# EAGLE schematic oresat-batteries (EAGLE 9.6.2)

## Sheet 1 of 5: Connectors/MCU
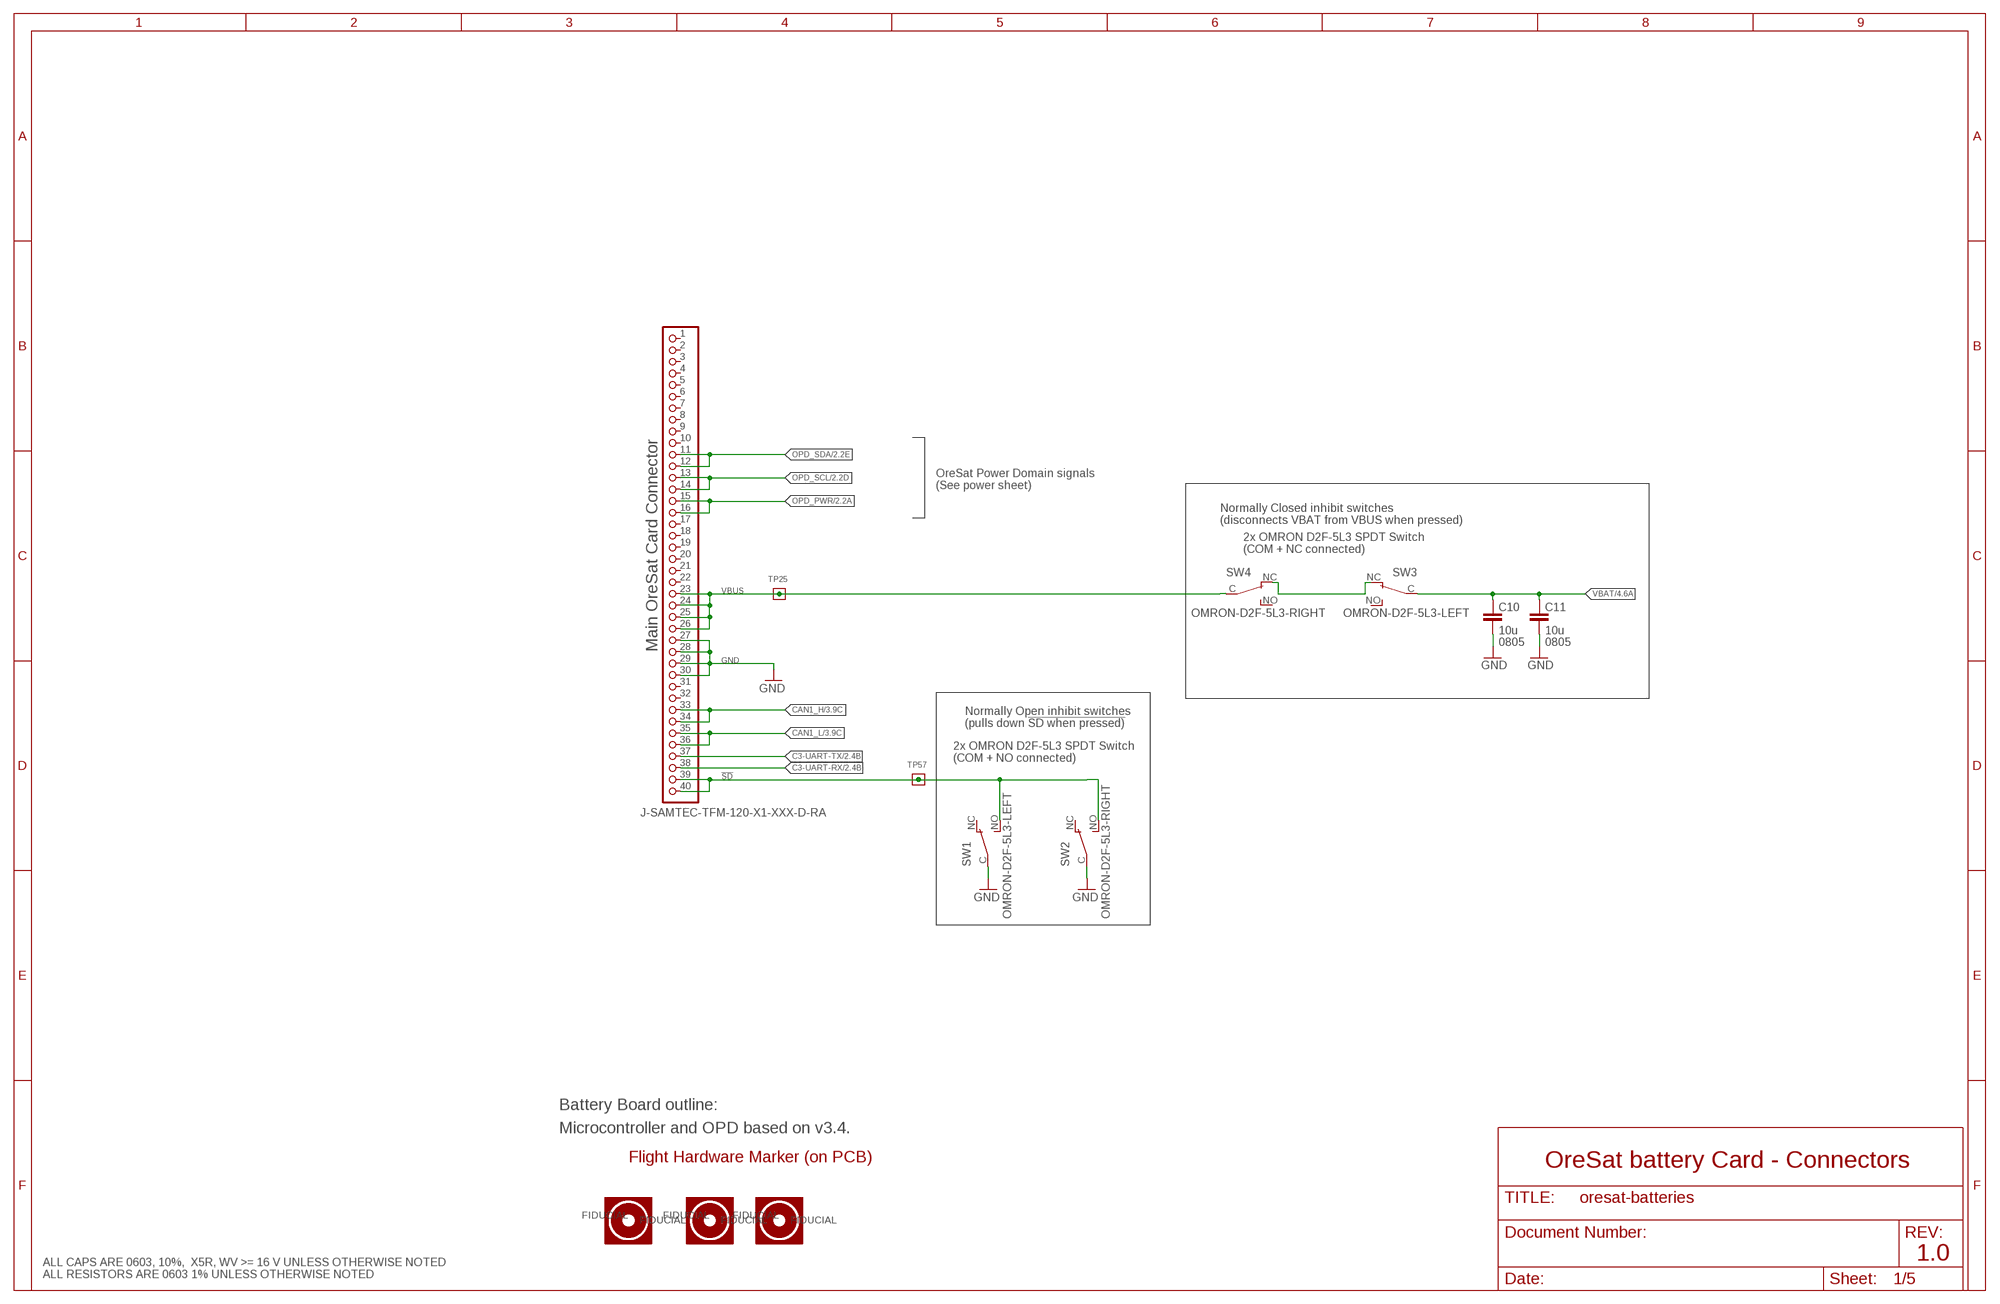
[diagram p0: schematic, sheet 1]

### Parts
C10  10u  C-EU0805-B-NOSILK  [.0805-B-NOSILK]
C11  10u  C-EU0805-B-NOSILK  [.0805-B-NOSILK]
FIDUCIAL1  FIDUCIAL-1.0X2.0  [FIDUCIAL-1.0X2.0]
FIDUCIAL2  FIDUCIAL-1.0X2.0  [FIDUCIAL-1.0X2.0]
FIDUCIAL3  FIDUCIAL-1.0X2.0  [FIDUCIAL-1.0X2.0]
J1  J-SAMTEC-TFM-120-X1-XXX-D-RA  [J-SAMTEC-TFM-120-X1-XXX-D-RA]
SW1  OMRON-D2F-5L3-LEFT  OMRON-D2F-L3-D-LEFT  [D2F-L3-D-HORIZONTAL-L]
SW2  OMRON-D2F-5L3-RIGHT  OMRON-D2F-L3-D-RIGHT  [D2F-L3-D-HORIZONTAL-R]
SW3  OMRON-D2F-5L3-LEFT  OMRON-D2F-L3-D-LEFT  [D2F-L3-D-HORIZONTAL-L]
SW4  OMRON-D2F-5L3-RIGHT  OMRON-D2F-L3-D-RIGHT  [D2F-L3-D-HORIZONTAL-R]
TP25  TEST-POINT-LARGE-SQUARE  [1X01]
TP57  TEST-POINT-LARGE-SQUARE  [1X01]
U$1  FLIGHMARKERNEW  [FLIGHTMARKER_NEW_BOARDS]

### Nets
!SD [SHUTDOWN]: J1.39 J1.40 SW1.NO SW2.NO TP57.1 ; also sheet 4,5
C3-UART-RX: J1.38 ; also sheet 2
C3-UART-TX: J1.37 ; also sheet 2
CAN1_H: J1.33 J1.34 ; also sheet 3
CAN1_L: J1.35 J1.36 ; also sheet 3
GND: C10.2 C11.2 J1.27 J1.28 J1.29 J1.30 SW1.C(COM) SW2.C(COM) ; also sheet 2,3,4,5
INTERSW: SW3.NC SW4.NC
OPD_PWR: J1.15 J1.16 ; also sheet 2
OPD_SCL: J1.13 J1.14 ; also sheet 2
OPD_SDA: J1.11 J1.12 ; also sheet 2
VBAT: C10.1 C11.1 SW3.C(COM) ; also sheet 4,5
VBUS [BATTERY]: J1.23 J1.24 J1.25 J1.26 SW4.C(COM) TP25.1 ; also sheet 2
Unconnected: FIDUCIAL1.FIDUCIAL FIDUCIAL2.FIDUCIAL FIDUCIAL3.FIDUCIAL J1.1 J1.2 J1.3 J1.4 J1.5 J1.6 J1.7 J1.8 J1.9 J1.10 J1.17 J1.18 J1.19 J1.20 J1.21 J1.22 J1.31 J1.32 SW1.NC SW2.NC SW3.NO SW4.NO

### Notes on the sheet
- OreSat Power Domain signals
  (See power sheet)
- Normally Closed inhibit switches
  (disconnects VBAT from VBUS when pressed)
- 2x OMRON D2F-5L3 SPDT Switch
  (COM + NC connected)
- 0805 | 0805
- Main OreSat Card Connector
- Normally Open inhibit switches
  (pulls down !SD when pressed)
- 2x OMRON D2F-5L3 SPDT Switch
  (COM + NO connected)
- Battery Board outline:
- Microcontroller and OPD based on v3.4.
- OreSat battery Card - Connectors
- 1.0
- ALL CAPS ARE 0603, 10%,  X5R, WV >= 16 V UNLESS OTHERWISE NOTED
  ALL RESISTORS ARE 0603 1% UNLESS OTHERWISE NOTED

## Sheet 2 of 5: Power
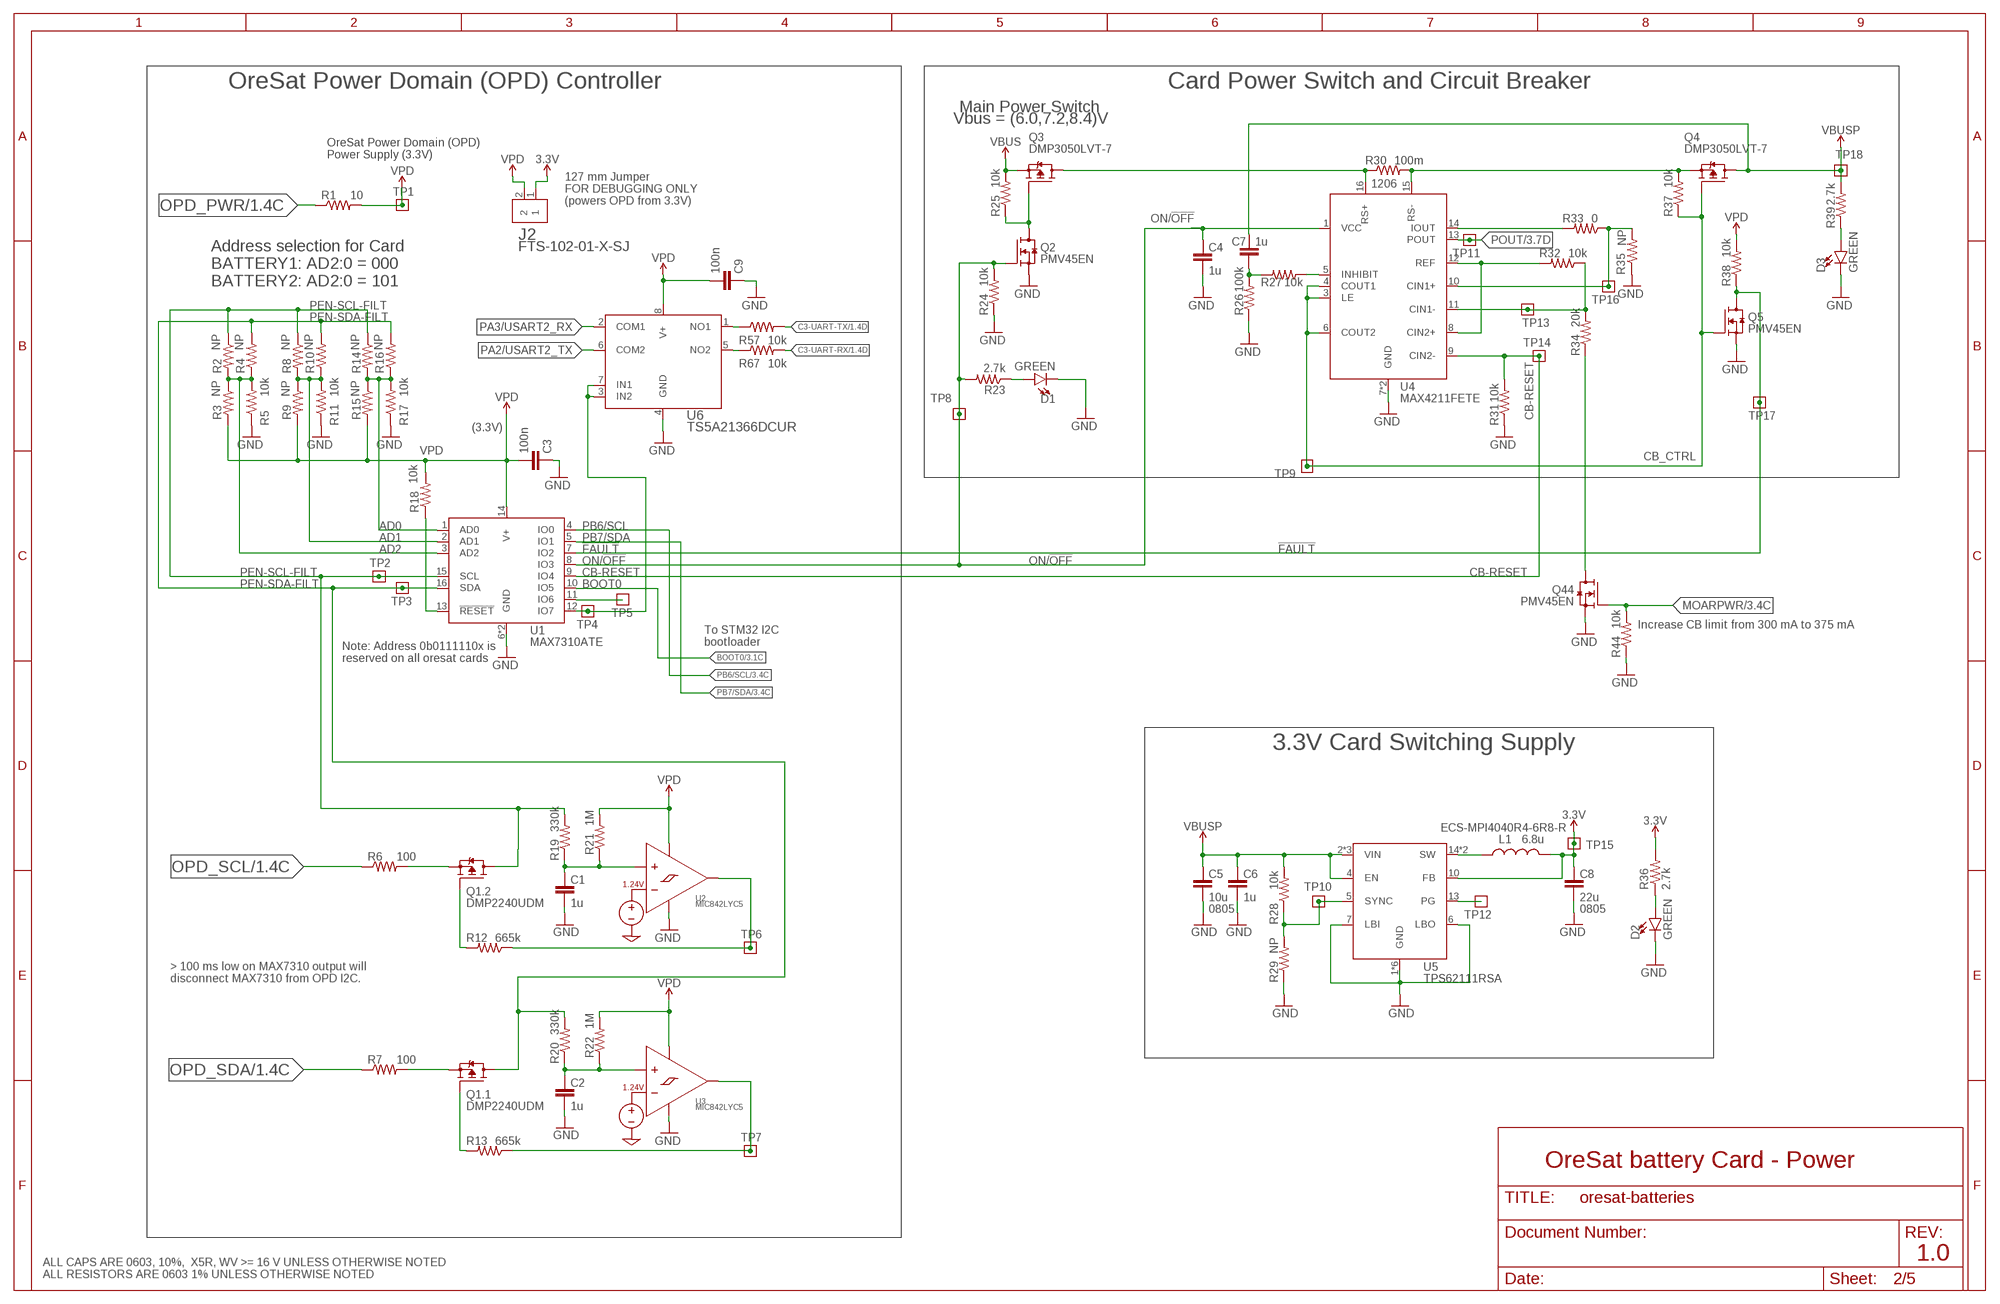
[diagram p1: schematic, sheet 2]

### Parts
C1  1u  C-EU0603-C-NOSILK  [.0603-C-NOSILK]
C2  1u  C-EU0603-C-NOSILK  [.0603-C-NOSILK]
C3  100n  C-EU0603-C-NOSILK  [.0603-C-NOSILK]
C4  1u  C-EU0603-C-NOSILK  [.0603-C-NOSILK]
C5  10u  C-EU0805-B-NOSILK  [.0805-B-NOSILK]
C6  1u  C-EU0603-C-NOSILK  [.0603-C-NOSILK]
C7  1u  C-EU0603-C-NOSILK  [.0603-C-NOSILK]
C8  22u  C-EU0805-B-NOSILK  [.0805-B-NOSILK]
C9  100n  C-EU0603-C-NOSILK  [.0603-C-NOSILK]
D1  GREEN  LED-GREEN0603  [LED-0603]
D2  GREEN  LED-GREEN0603  [LED-0603]
D3  GREEN  LED-GREEN0603  [LED-0603]
J2  FTS-102-01-X-SJ  SAMTEC-FTS-102-01-X-SJ  [SAMTEC-FTS-102-01-X-S]
L1  6.8u  L-ECS-MPI4040  [ECS-MPI4040]
Q1  DMP2240UDM  MOSFET-PCH-SOT23-6  [SOT23-6]
Q2  PMV45EN  N-MOSFET-SOT-23-3  [SOT23-3]
Q3  DMP3050LVT-7  MOSFET-PCH-SOT23-6  [SOT23-6]
Q4  DMP3050LVT-7  MOSFET-PCH-SOT23-6  [SOT23-6]
Q5  PMV45EN  N-MOSFET-SOT-23-3  [SOT23-3]
Q44  PMV45EN  N-MOSFET-SOT-23-3  [SOT23-3]
R1  10  R-US_0603-C-NOSILK  [.0603-C-NOSILK]
R2  NP  R-US_0603-C-NOSILK  [.0603-C-NOSILK]
R3  NP  R-US_0603-C-NOSILK  [.0603-C-NOSILK]
R4  NP  R-US_0603-C-NOSILK  [.0603-C-NOSILK]
R5  10k  R-US_0603-C-NOSILK  [.0603-C-NOSILK]
R6  100  R-US_0603-C-NOSILK  [.0603-C-NOSILK]
R7  100  R-US_0603-C-NOSILK  [.0603-C-NOSILK]
R8  NP  R-US_0603-C-NOSILK  [.0603-C-NOSILK]
R9  NP  R-US_0603-C-NOSILK  [.0603-C-NOSILK]
R10  NP  R-US_0603-C-NOSILK  [.0603-C-NOSILK]
R11  10k  R-US_0603-C-NOSILK  [.0603-C-NOSILK]
R12  665k  R-US_0603-C-NOSILK  [.0603-C-NOSILK]
R13  665k  R-US_0603-C-NOSILK  [.0603-C-NOSILK]
R14  NP  R-US_0603-C-NOSILK  [.0603-C-NOSILK]
R15  NP  R-US_0603-C-NOSILK  [.0603-C-NOSILK]
R16  NP  R-US_0603-C-NOSILK  [.0603-C-NOSILK]
R17  10k  R-US_0603-C-NOSILK  [.0603-C-NOSILK]
R18  10k  R-US_0603-C-NOSILK  [.0603-C-NOSILK]
R19  330k  R-US_0603-C-NOSILK  [.0603-C-NOSILK]
R20  330k  R-US_0603-C-NOSILK  [.0603-C-NOSILK]
R21  1M  R-US_0603-C-NOSILK  [.0603-C-NOSILK]
R22  1M  R-US_0603-C-NOSILK  [.0603-C-NOSILK]
R23  2.7k  R-US_0603-C-NOSILK  [.0603-C-NOSILK]
R24  10k  R-US_0603-C-NOSILK  [.0603-C-NOSILK]
R25  10k  R-US_0603-C-NOSILK  [.0603-C-NOSILK]
R26  100k  R-US_0603-C-NOSILK  [.0603-C-NOSILK]
R27  10k  R-US_0603-C-NOSILK  [.0603-C-NOSILK]
R28  10k  R-US_0603-C-NOSILK  [.0603-C-NOSILK]
R29  NP  R-US_0603-C-NOSILK  [.0603-C-NOSILK]
R30  100m  R-US_1206-C  [1206-C]
R31  10k  R-US_0603-C-NOSILK  [.0603-C-NOSILK]
R32  10k  R-US_0603-C-NOSILK  [.0603-C-NOSILK]
R33  0  R-US_0603-C-NOSILK  [.0603-C-NOSILK]
R34  20k  R-US_0603-C-NOSILK  [.0603-C-NOSILK]
R35  NP  R-US_0603-C-NOSILK  [.0603-C-NOSILK]
R36  2.7k  R-US_0603-C-NOSILK  [.0603-C-NOSILK]
R37  10k  R-US_0603-C-NOSILK  [.0603-C-NOSILK]
R38  10k  R-US_0603-C-NOSILK  [.0603-C-NOSILK]
R39  2.7k  R-US_0603-C-NOSILK  [.0603-C-NOSILK]
R44  10k  R-US_0603-C-NOSILK  [.0603-C-NOSILK]
R57  10k  R-US_0603-C-NOSILK  [.0603-C-NOSILK]
R67  10k  R-US_0603-C-NOSILK  [.0603-C-NOSILK]
TP1  TEST-POINT-LARGE-SQUARE  [1X01]
TP2  TEST-POINT-LARGE-SQUARE  [1X01]
TP3  TEST-POINT-LARGE-SQUARE  [1X01]
TP4  TEST-POINT-LARGE-SQUARE  [1X01]
TP5  TEST-POINT-LARGE-SQUARE  [1X01]
TP6  TEST-POINT-LARGE-SQUARE  [1X01]
TP7  TEST-POINT-LARGE-SQUARE  [1X01]
TP8  TEST-POINT-LARGE-SQUARE  [1X01]
TP9  TEST-POINT-LARGE-SQUARE  [1X01]
TP10  TEST-POINT-LARGE-SQUARE  [1X01]
TP11  TEST-POINT-LARGE-SQUARE  [1X01]
TP12  TEST-POINT-LARGE-SQUARE  [1X01]
TP13  TEST-POINT-LARGE-SQUARE  [1X01]
TP14  TEST-POINT-LARGE-SQUARE  [1X01]
TP15  TEST-POINT-LARGE-SQUARE  [1X01]
TP16  TEST-POINT-LARGE-SQUARE  [1X01]
TP17  TEST-POINT-LARGE-SQUARE  [1X01]
TP18  TEST-POINT-LARGE-SQUARE  [1X01]
U1  MAX7310ATE  MAX7310  [QFN65P400X400X80-17T210]
U2  MIC842LYC5  [SC70-5]
U3  MIC842LYC5  [SC70-5]
U4  MAX4211FETE  MAX4211  [QFN65P400X400X80-17T210]
U5  TPS62111RSA  TPS6211X  [S-PVQFN-16]
U6  TS5A21366DCUR  [DCU0008A_N]

### Nets
3.3V: C8.1 J2.1 L1.2 R36.2 TP15.1 U5.10(FB) ; also sheet 3
!FAULT: Q5.3(D) R38.1 TP17.1 U1.7(IO2)
AD0: R14.2 R15.1 R16.1 R17.2 U1.1(AD0)
AD1: R8.2 R9.1 R10.1 R11.2 U1.2(AD1)
AD2: R2.2 R3.1 R4.1 R5.2 U1.3(AD2)
BOOT0: U1.10(IO5) ; also sheet 3
C3-UART-RX: R67.2 ; also sheet 1
C3-UART-TX: R57.2 ; also sheet 1
CB-RESET: R31.2 TP14.1 U1.9(IO4) U4.9(CIN2-)
CB_CTRL: Q4.3(G) Q5.1(G) R37.1 TP9.1 U4.3(LE) U4.4(COUT1) U4.6(COUT2)
GND: C1.2 C2.2 C3.1 C4.2 C5.2 C6.2 C8.2 C9.1 D1.C D2.C D3.C Q2.2(S) Q5.2(S) Q44.2(S) R5.1 R11.1 R17.1 R24.1 R26.1 R29.1 R31.1 R35.1 R44.1 U1.6(GND) U1.EPAD(GND) U2.2(GND) U3.2(GND) U4.7(GND) U4.EPAD(GND) U5.1(GND) U5.6(LBO) U5.7(LBI) U5.9(GND) U5.11(GND) U5.12(GND) U5.16(GND) U5.PAD(GND) U6.4(GND) ; also sheet 1,3,4,5
IOUT1: R33.2 U4.14(IOUT)
MOARPWR: Q44.1(G) R44.2 ; also sheet 3
N$1: R57.1 U6.1(NO1)
N$13: R67.1 U6.5(NO2)
N$19: D3.A R39.1
N$20: D2.A R36.1
N$21: R18.1 U1.13(!RESET)
N$23: Q2.3(D) Q3.3(G) R25.1
N$24: Q3.1(D) Q3.2(D) Q3.5(D) Q3.6(D) R30.1 U4.16(RS+)
N$28: Q1.1(.1:G) R13.2
N$29: Q44.3(D) R34.1
N$30: Q1.3(.2:G) R12.2
N$32: R33.1 R35.2 TP16.1 U4.10(CIN1+)
N$33: R32.1 R34.2 TP13.1 U4.11(CIN1-)
N$34: R32.2 U4.8(CIN2+) U4.12(REF)
N$35: R27.1 U4.5(INHIBIT)
N$36: C7.1 R26.2 R27.2
N$38: Q4.4(S) R30.2 R37.2 U4.15(RS-)
N$39: D1.A R23.1
N$45: Q1.5(.1:S) R7.2
N$47: R13.1 TP7.1 U3.4(OUT)
N$49: TP5.1 U1.11(IO6)
N$52: Q1.2(.2:S) R6.2
N$57: R12.1 TP6.1 U2.4(OUT)
N$58: C1.1 R19.1 R21.1 U2.1(INP)
N$59: C2.1 R20.1 R22.1 U3.1(INP)
N$60: TP4.1 U1.12(IO7) U6.3(IN2) U6.7(IN1)
ON/!OFF: C4.1 Q2.1(G) R23.2 R24.2 TP8.1 U1.8(IO3) U4.1(VCC)
OPD_PWR: R1.1 ; also sheet 1
OPD_SCL: R6.1 ; also sheet 1
OPD_SDA: R7.1 ; also sheet 1
PA2/USART2_TX: U6.6(COM2) ; also sheet 3
PA3/USART2_RX: U6.2(COM1) ; also sheet 3
PB6/SCL: U1.4(IO0) ; also sheet 3,5
PB7/SDA: U1.5(IO1) ; also sheet 3,5
PEN-SCL-FILT: Q1.4(.2:D) R2.1 R8.1 R14.1 R19.2 TP2.1 U1.15(SCL)
PEN-SDA-FILT: Q1.6(.1:D) R4.2 R10.2 R16.2 R20.2 TP3.1 U1.16(SDA)
POUT: TP11.1 U4.13(POUT) ; also sheet 3
TPS62111-PG1: TP12.1 U5.13(PG)
TPS62111-SYNC1: R28.1 R29.2 TP10.1 U5.5(SYNC)
TPS62111_SW1: L1.1 U5.14(SW) U5.15(SW)
VBUS [BATTERY]: Q3.4(S) R25.2 ; also sheet 1
VBUSP: C5.1 C6.1 C7.2 Q4.1(D) Q4.2(D) Q4.5(D) Q4.6(D) R28.2 R39.2 TP18.1 U5.2(VIN) U5.3(VIN) U5.4(EN) U5.8(VIN) ; also sheet 3
VPD: C3.2 C9.2 J2.2 R1.2 R3.2 R9.2 R15.2 R18.2 R21.2 R22.2 R38.2 TP1.1 U1.14(V+) U2.5(VDD) U3.5(VDD) U6.8(V+)

### Notes on the sheet
- OreSat Power Domain (OPD) Controller | Card Power Switch and Circuit Breaker
- Main Power Switch
- Vbus = (6.0,7.2,8.4)V
- OreSat Power Domain (OPD)
  Power Supply (3.3V)
- 1206
- 127 mm Jumper
  FOR DEBUGGING ONLY
  (powers OPD from 3.3V)
- Address selection for Card
- BATTERY1: AD2:0 = 000
  BATTERY2: AD2:0 = 101
- (3.3V)
- Increase CB limit from 300 mA to 375 mA
- To STM32 I2C
  bootloader
- Note: Address 0b0111110x is 
  reserved on all oresat cards
- 3.3V Card Switching Supply
- ECS-MPI4040R4-6R8-R
- 0805 | 0805
- > 100 ms low on MAX7310 output will
  disconnect MAX7310 from OPD I2C.
- OreSat battery Card - Power
- 1.0
- ALL CAPS ARE 0603, 10%,  X5R, WV >= 16 V UNLESS OTHERWISE NOTED
  ALL RESISTORS ARE 0603 1% UNLESS OTHERWISE NOTED

## Sheet 3 of 5: Microcontroller
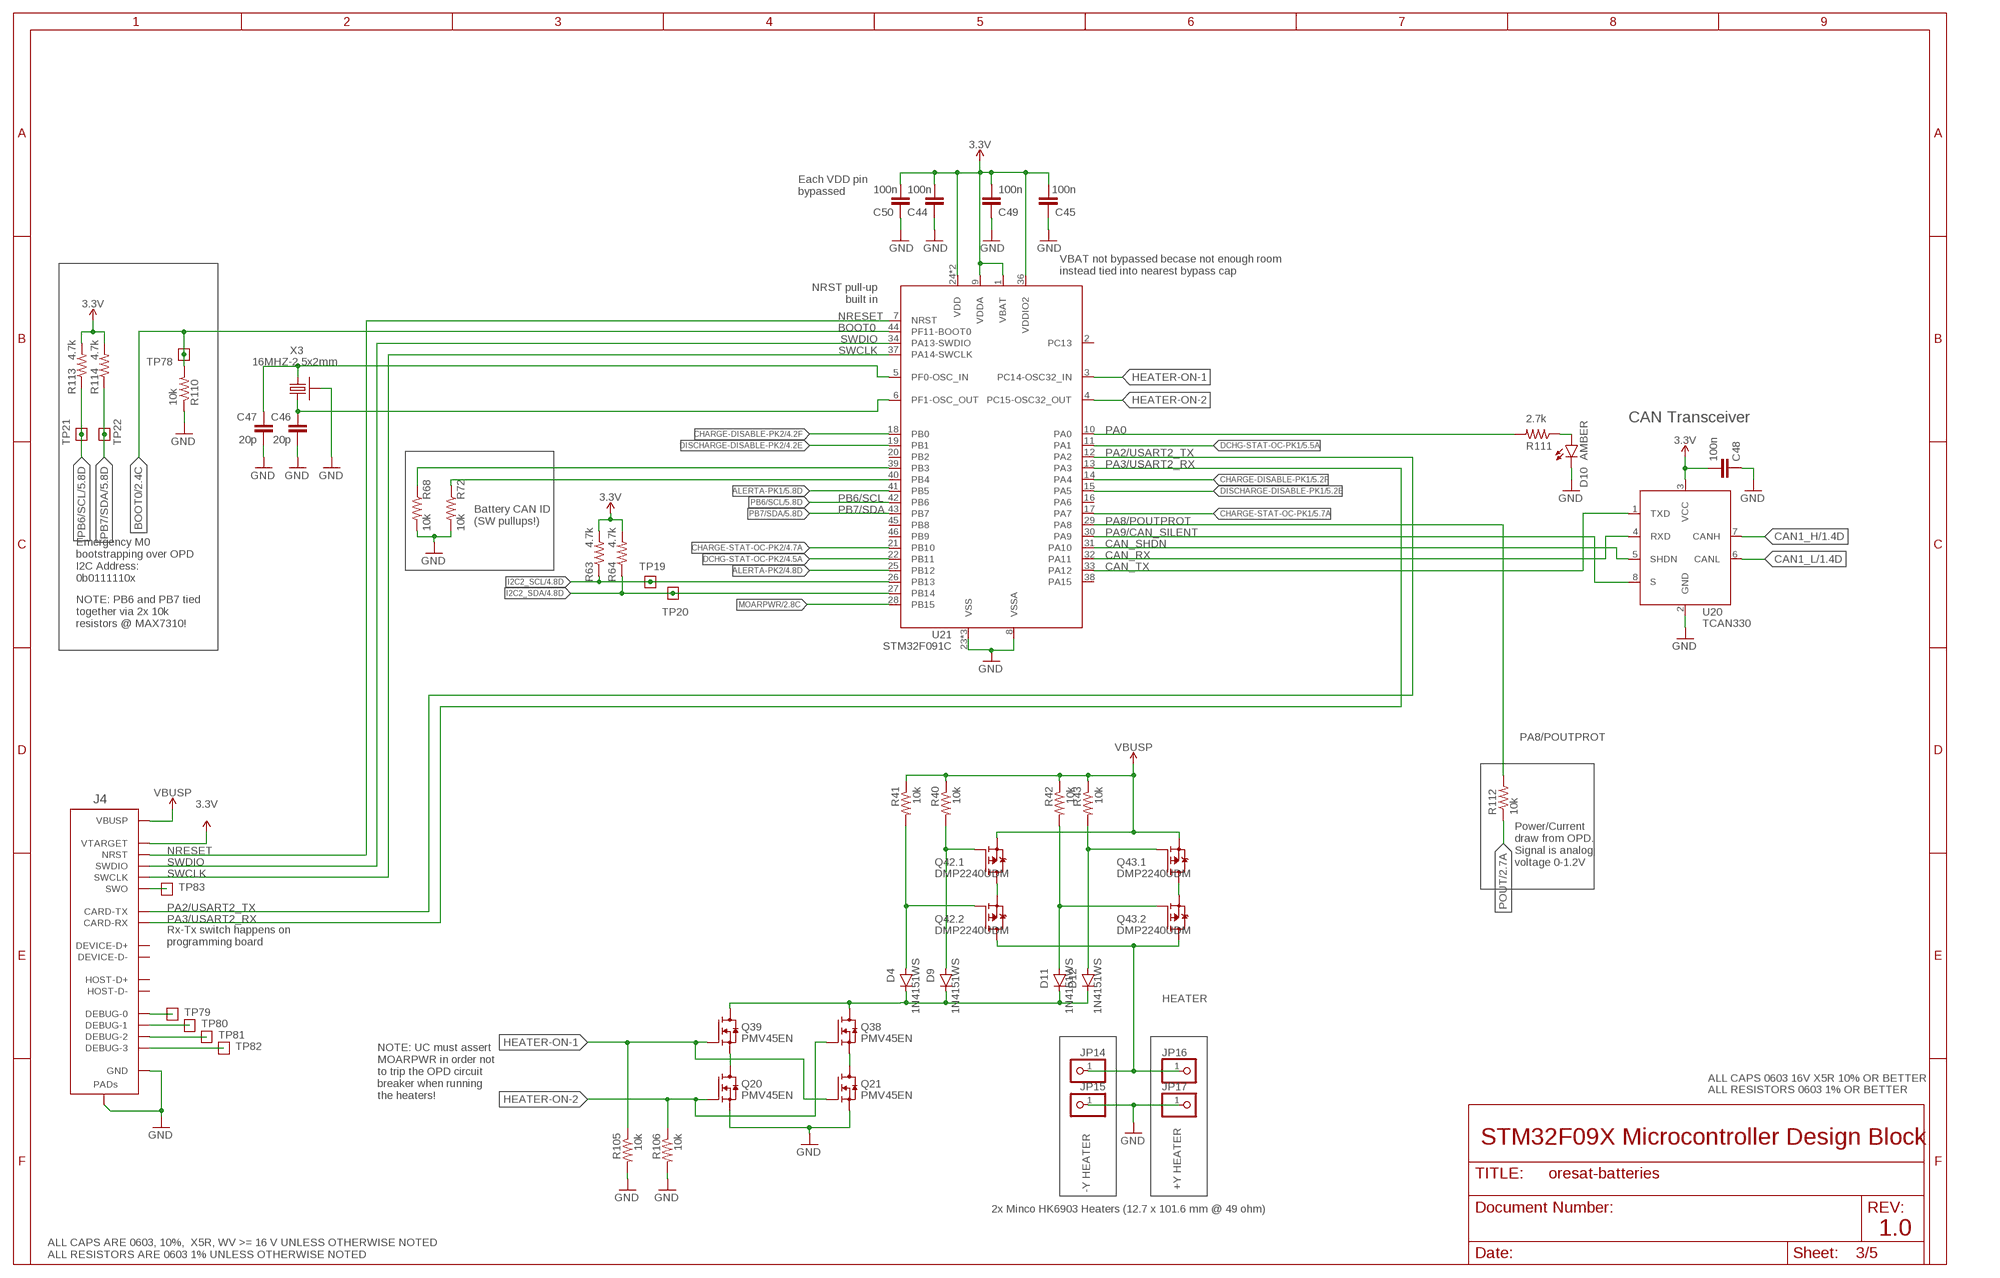
[diagram p2: schematic, sheet 3]

### Parts
C44  100n  C-EU0603-C-NOSILK  [.0603-C-NOSILK]
C45  100n  C-EU0603-C-NOSILK  [.0603-C-NOSILK]
C46  20p  C-EU0603-C-NOSILK  [.0603-C-NOSILK]
C47  20p  C-EU0603-C-NOSILK  [.0603-C-NOSILK]
C48  100n  C-EU0603-C-NOSILK  [.0603-C-NOSILK]
C49  100n  C-EU0603-C-NOSILK  [.0603-C-NOSILK]
C50  100n  C-EU0603-C-NOSILK  [.0603-C-NOSILK]
D4  1N4151WS  DIODE-SOD323-R  [SOD323-R]
D9  1N4151WS  DIODE-SOD323-R  [SOD323-R]
D10  AMBER  LED-GREEN0603  [LED-0603]
D11  1N4151WS  DIODE-SOD323-R  [SOD323-R]
D12  1N4151WS  DIODE-SOD323-R  [SOD323-R]
J4  ORESAT-DEBUG-CONNECTOR-ALL  [TE_2-1734592-0]
JP14  PINHD-1X1  [1X01]
JP15  PINHD-1X1  [1X01]
JP16  PINHD-1X1  [1X01]
JP17  PINHD-1X1  [1X01]
Q20  PMV45EN  N-MOSFET-SOT-23-3  [SOT23-3]
Q21  PMV45EN  N-MOSFET-SOT-23-3  [SOT23-3]
Q38  PMV45EN  N-MOSFET-SOT-23-3  [SOT23-3]
Q39  PMV45EN  N-MOSFET-SOT-23-3  [SOT23-3]
Q42  DMP2240UDM  MOSFET-PCH-SOT23-6  [SOT23-6]
Q43  DMP2240UDM  MOSFET-PCH-SOT23-6  [SOT23-6]
R40  10k  R-US_0603-C-NOSILK  [.0603-C-NOSILK]
R41  10k  R-US_0603-C-NOSILK  [.0603-C-NOSILK]
R42  10k  R-US_0603-C-NOSILK  [.0603-C-NOSILK]
R43  10k  R-US_0603-C-NOSILK  [.0603-C-NOSILK]
R63  4.7k  R-US_0603-C-NOSILK  [.0603-C-NOSILK]
R64  4.7k  R-US_0603-C-NOSILK  [.0603-C-NOSILK]
R68  10k  R-US_0603-C-NOSILK  [.0603-C-NOSILK]
R72  10k  R-US_0603-C-NOSILK  [.0603-C-NOSILK]
R105  10k  R-US_0603-C-NOSILK  [.0603-C-NOSILK]
R106  10k  R-US_0603-C-NOSILK  [.0603-C-NOSILK]
R110  10k  R-US_0603-C-NOSILK  [.0603-C-NOSILK]
R111  2.7k  R-US_0603-C-NOSILK  [.0603-C-NOSILK]
R112  10k  R-US_0603-C-NOSILK  [.0603-C-NOSILK]
R113  4.7k  R-US_0603-C-NOSILK  [.0603-C-NOSILK]
R114  4.7k  R-US_0603-C-NOSILK  [.0603-C-NOSILK]
TP19  TEST-POINT-LARGE-SQUARE  [1X01]
TP20  TEST-POINT-LARGE-SQUARE  [1X01]
TP21  TEST-POINT-LARGE-SQUARE  [1X01]
TP22  TEST-POINT-LARGE-SQUARE  [1X01]
TP78  TEST-POINT-LARGE-SQUARE  [1X01]
TP79  TEST-POINT-LARGE-SQUARE  [1X01]
TP80  TEST-POINT-LARGE-SQUARE  [1X01]
TP81  TEST-POINT-LARGE-SQUARE  [1X01]
TP82  TEST-POINT-LARGE-SQUARE  [1X01]
TP83  TEST-POINT-LARGE-SQUARE  [1X01]
U20  TCAN330  [SOT23-8_TI-DCN]
U21  STM32F091C  [STM32F091C]
X3  16MHZ-2.5x2mm  CRYSTAL-WITH-GND  [CRYSTAL_2.5X2]

### Nets
3.3V: C44.2 C45.2 C48.2 C49.2 C50.2 J4.11(VTARGET) R63.2 R64.2 R113.2 R114.2 U20.3(VCC) U21.1(VBAT) U21.9(VDDA) U21.24(VDD) U21.36(VDDIO2) U21.48(VDD) ; also sheet 2
ALERTA-PK1: U21.41(PB5) ; also sheet 5
ALERTA-PK2: U21.25(PB12) ; also sheet 4
BOOT0: R110.2 TP78.1 U21.44(PF11-BOOT0) ; also sheet 2
CAN1_H: U20.7(CANH) ; also sheet 1
CAN1_L: U20.6(CANL) ; also sheet 1
CAN_RX: U20.4(RXD) U21.32(PA11)
CAN_SHDN: U20.5(SHDN) U21.31(PA10)
CAN_TX: U20.1(TXD) U21.33(PA12)
CHARGE-DISABLE-PK1: U21.14(PA4) ; also sheet 5
CHARGE-DISABLE-PK2: U21.18(PB0) ; also sheet 4
CHARGE-STAT-OC-PK1: U21.17(PA7) ; also sheet 5
CHARGE-STAT-OC-PK2: U21.21(PB10) ; also sheet 4
CRYSTALIN2: C47.1 U21.5(PF0-OSC_IN) X3.1
CRYSTALOUT2: C46.1 U21.6(PF1-OSC_OUT) X3.3
DCHG-STAT-OC-PK1: U21.11(PA1) ; also sheet 5
DCHG-STAT-OC-PK2: U21.22(PB11) ; also sheet 4
DISCHARGE-DISABLE-PK1: U21.15(PA5) ; also sheet 5
DISCHARGE-DISABLE-PK2: U21.19(PB1) ; also sheet 4
GND: C44.1 C45.1 C46.2 C47.2 C48.1 C49.1 C50.1 D10.C J4.3(GND) J4.6(GND) J4.9(GND) J4.PAD1(PAD) J4.PAD2(PAD) JP15.1 JP17.1 Q20.2(S) Q21.2(S) R68.2 R72.2 R105.2 R106.2 R110.1 U20.2(GND) U21.8(VSSA) U21.23(VSS) U21.35(VSS) U21.47(VSS) X3.2(SHIELD) X3.4(SHIELD) ; also sheet 1,2,4,5
HEATER: JP14.1 JP16.1 Q42.4(.2:D) Q43.4(.2:D)
HEATER-ON-1: Q21.1(G) Q39.1(G) R105.1 U21.3(PC14-OSC32_IN)
HEATER-ON-2: Q20.1(G) Q38.1(G) R106.1 U21.4(PC15-OSC32_OUT)
I2C2_SCL: R63.1 TP19.1 U21.26(PB13) ; also sheet 4
I2C2_SDA: R64.1 TP20.1 U21.27(PB14) ; also sheet 4
MOARPWR: U21.28(PB15) ; also sheet 2
N$18: D11.A Q43.3(.2:G) R42.2
N$25: D4.A Q42.3(.2:G) R41.2
N$26: Q42.2(.2:S) Q42.6(.1:D)
N$27: Q43.2(.2:S) Q43.6(.1:D)
N$54: R68.1 U21.39(PB3)
N$62: D12.A Q43.1(.1:G) R43.2
N$63: D9.A Q42.1(.1:G) R40.2
N$64: D4.C D9.C D11.C D12.C Q38.3(D) Q39.3(D)
N$88: Q20.3(D) Q39.2(S)
N$92: Q21.3(D) Q38.2(S)
N$99: R72.1 U21.40(PB4)
N$101: D10.A R111.1
N$102: J4.20(DEBUG-3) TP82.1
N$103: J4.19(DEBUG-2) TP81.1
N$104: J4.18(DEBUG-1) TP80.1
N$105: J4.17(DEBUG-0) TP79.1
N$106: J4.16(SWO) TP83.1
NRESET: J4.10(NRST) U21.7(NRST)
PA0: R111.2 U21.10(PA0)
PA2/USART2_TX: J4.13(CARD-TX) U21.12(PA2) ; also sheet 2
PA3/USART2_RX: J4.12(CARD-RX) U21.13(PA3) ; also sheet 2
PA8/POUTPROT: R112.2 U21.29(PA8)
PA9/CAN_SILENT: U20.8(S) U21.30(PA9)
PB6/SCL: R113.1 TP21.1 U21.42(PB6) ; also sheet 2,5
PB7/SDA: R114.1 TP22.1 U21.43(PB7) ; also sheet 2,5
POUT: R112.1 ; also sheet 2
SWCLK: J4.15(SWCLK) U21.37(PA14-SWCLK)
SWDIO: J4.14(SWDIO) U21.34(PA13-SWDIO)
VBUSP: J4.1(VBUSP) J4.2(VBUSP) Q42.5(.1:S) Q43.5(.1:S) R40.1 R41.1 R42.1 R43.1 ; also sheet 2
Unconnected: J4.4(DEVICE-D+) J4.5(DEVICE-D-) J4.7(HOST-D+) J4.8(HOST-D-) U21.2(PC13) U21.16(PA6) U21.20(PB2) U21.38(PA15) U21.45(PB8) U21.46(PB9)

### Notes on the sheet
- Each VDD pin
  bypassed
- VBAT not bypassed becase not enough room
  instead tied into nearest bypass cap
- NRST pull-up
  built in
- CAN Transceiver
- Battery CAN ID
  (SW pullups!)
- Emergency M0 
  bootstrapping over OPD 
  I2C Address: 
  0b0111110x
- NOTE: PB6 and PB7 tied
  together via 2x 10k
  resistors @ MAX7310!
- Power/Current 
  draw from OPD.
  Signal is analog 
  voltage 0-1.2V
- Rx-Tx switch happens on 
  programming board
- HEATER
- ALL CAPS 0603 16V X5R 10% OR BETTER
- ALL RESISTORS 0603 1% OR BETTER
- NOTE: UC must assert 
  MOARPWR in order not 
  to trip the OPD circuit 
  breaker when running
  the heaters!
- +Y HEATER
- -Y HEATER
- STM32F09X Microcontroller Design Block
- 2x Minco HK6903 Heaters (12.7 x 101.6 mm @ 49 ohm)
- 1.0
- ALL CAPS ARE 0603, 10%,  X5R, WV >= 16 V UNLESS OTHERWISE NOTED
  ALL RESISTORS ARE 0603 1% UNLESS OTHERWISE NOTED

## Sheet 4 of 5: Battery Pack 2 (TOP)
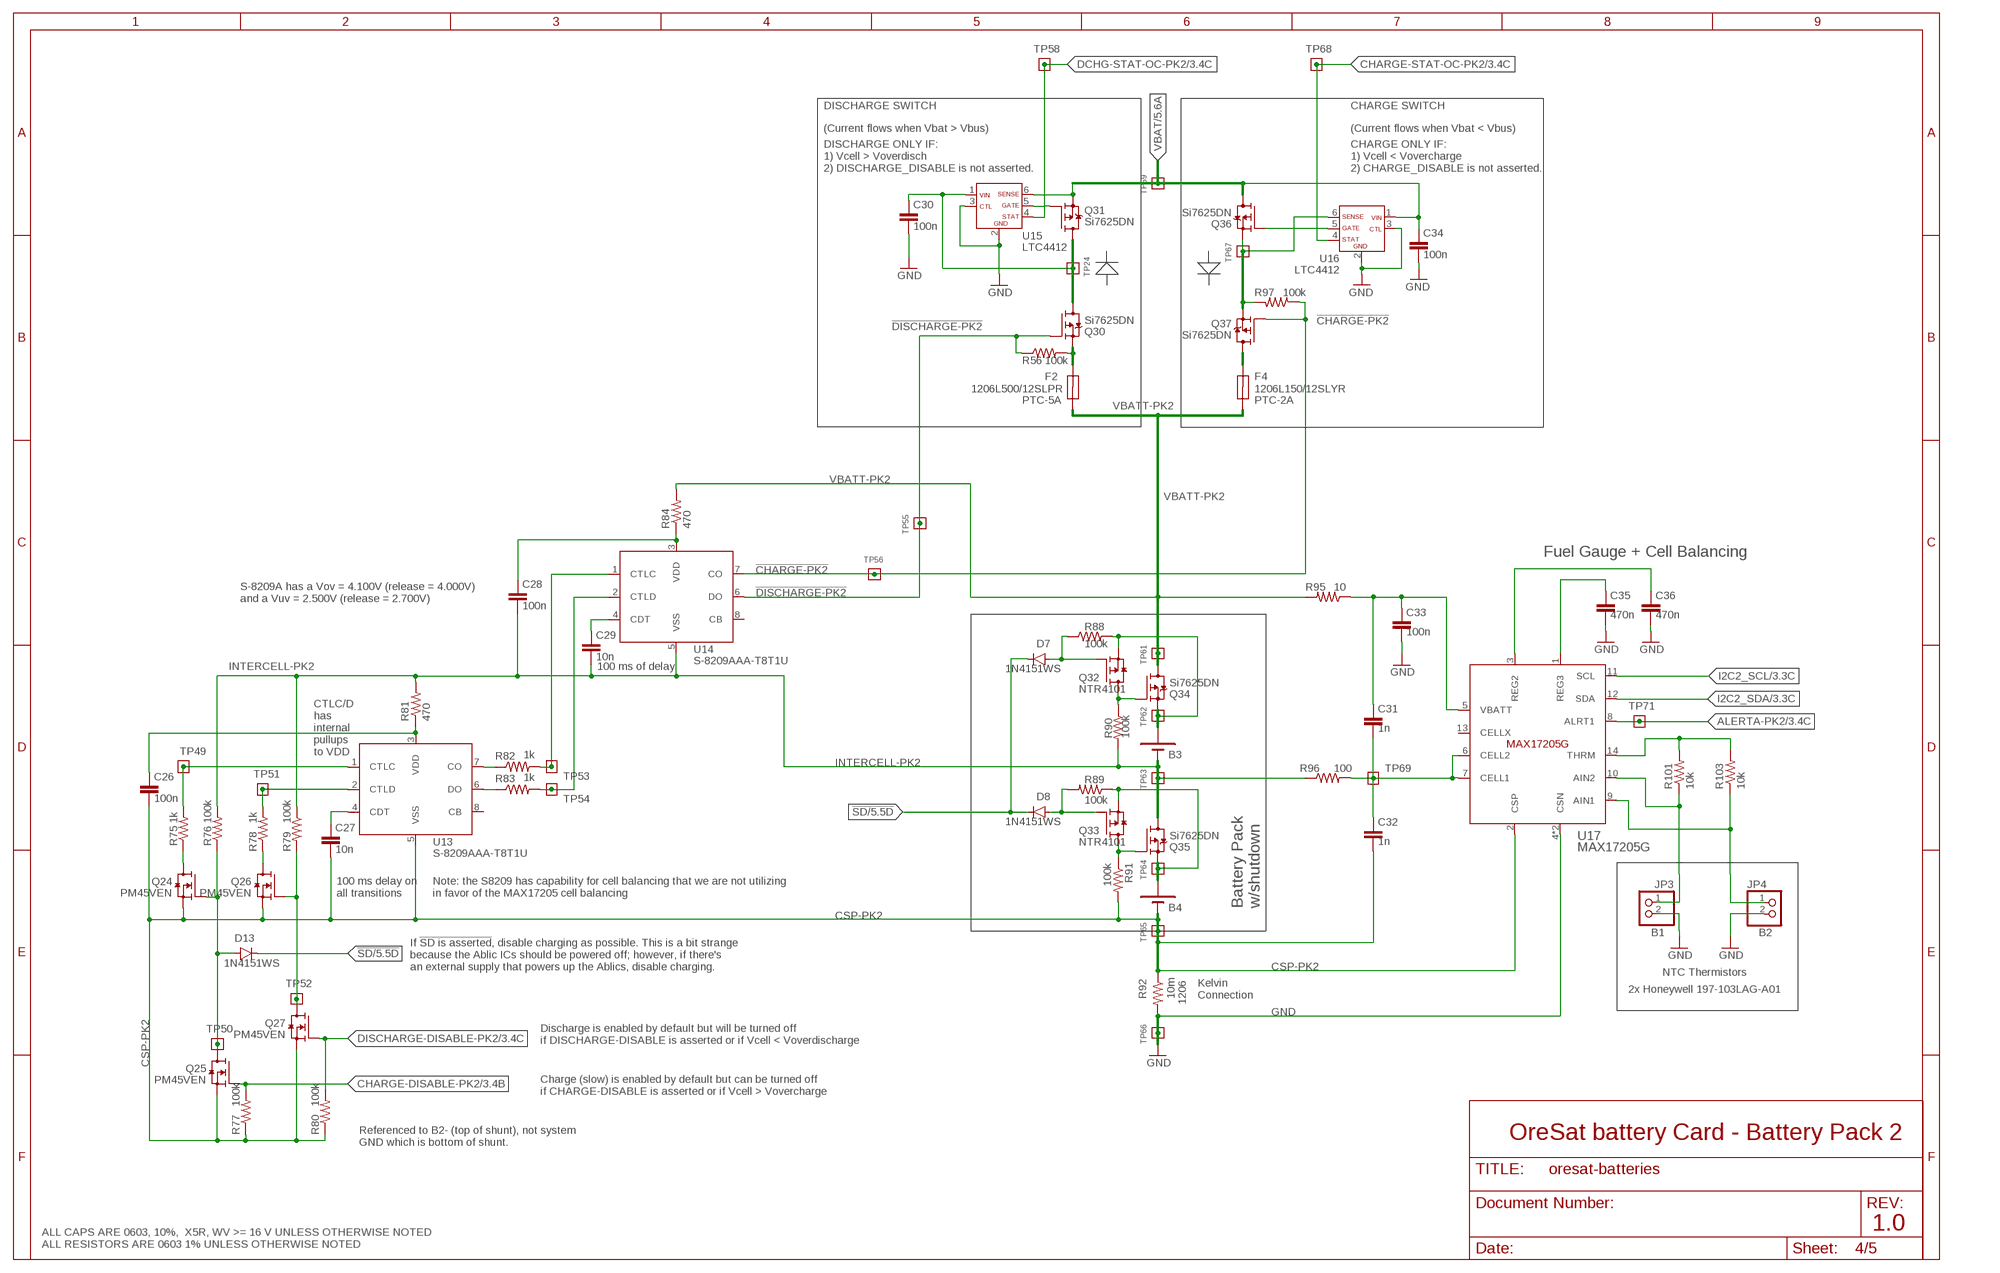
[diagram p3: schematic, sheet 4]

### Parts
B3  B-18650-LI-BATTERY  [18650]
B4  B-18650-LI-BATTERY  [18650]
C26  100n  C-EU0603-C-NOSILK  [.0603-C-NOSILK]
C27  10n  C-EU0603-C-NOSILK  [.0603-C-NOSILK]
C28  100n  C-EU0603-C-NOSILK  [.0603-C-NOSILK]
C29  10n  C-EU0603-C-NOSILK  [.0603-C-NOSILK]
C30  100n  C-EU0603-C-NOSILK  [.0603-C-NOSILK]
C31  1n  C-EU0603-C-NOSILK  [.0603-C-NOSILK]
C32  1n  C-EU0603-C-NOSILK  [.0603-C-NOSILK]
C33  100n  C-EU0603-C-NOSILK  [.0603-C-NOSILK]
C34  100n  C-EU0603-C-NOSILK  [.0603-C-NOSILK]
C35  470n  C-EU0603-C-NOSILK  [.0603-C-NOSILK]
C36  470n  C-EU0603-C-NOSILK  [.0603-C-NOSILK]
D7  1N4151WS  DIODE-SOD323-R  [SOD323-R]
D8  1N4151WS  DIODE-SOD323-R  [SOD323-R]
D13  1N4151WS  DIODE-SOD323-R  [SOD323-R]
F2  1206L500/12SLPR  GENERIC-FUSE-1206  [1206-C]
F4  1206L150/12SLYR  GENERIC-FUSE-1206  [1206-C]
JP3  PINHD-1X2  [1X02]
JP4  PINHD-1X2  [1X02]
Q24  PM45VEN  N-MOSFET-SOT-23-3  [SOT23-3]
Q25  PM45VEN  N-MOSFET-SOT-23-3  [SOT23-3]
Q26  PM45VEN  N-MOSFET-SOT-23-3  [SOT23-3]
Q27  PM45VEN  N-MOSFET-SOT-23-3  [SOT23-3]
Q30  Si7625DN  Q-VISHAY-MOSFET-PCH-POWERPAK-1212-8  [POWERPAK-1212-8]
Q31  Si7625DN  Q-VISHAY-MOSFET-PCH-POWERPAK-1212-8  [POWERPAK-1212-8]
Q32  NTR4101  P-MOSFET-SOT23-3  [SOT23-3]
Q33  NTR4101  P-MOSFET-SOT23-3  [SOT23-3]
Q34  Si7625DN  Q-VISHAY-MOSFET-PCH-POWERPAK-1212-8  [POWERPAK-1212-8]
Q35  Si7625DN  Q-VISHAY-MOSFET-PCH-POWERPAK-1212-8  [POWERPAK-1212-8]
Q36  Si7625DN  Q-VISHAY-MOSFET-PCH-POWERPAK-1212-8  [POWERPAK-1212-8]
Q37  Si7625DN  Q-VISHAY-MOSFET-PCH-POWERPAK-1212-8  [POWERPAK-1212-8]
R56  100k  R-US_0603-C-NOSILK  [.0603-C-NOSILK]
R75  1k  R-US_0603-C-NOSILK  [.0603-C-NOSILK]
R76  100k  R-US_0603-C-NOSILK  [.0603-C-NOSILK]
R77  100k  R-US_0603-C-NOSILK  [.0603-C-NOSILK]
R78  1k  R-US_0603-C-NOSILK  [.0603-C-NOSILK]
R79  100k  R-US_0603-C-NOSILK  [.0603-C-NOSILK]
R80  100k  R-US_0603-C-NOSILK  [.0603-C-NOSILK]
R81  470  R-US_0603-C-NOSILK  [.0603-C-NOSILK]
R82  1k  R-US_0603-C-NOSILK  [.0603-C-NOSILK]
R83  1k  R-US_0603-C-NOSILK  [.0603-C-NOSILK]
R84  470  R-US_0603-C-NOSILK  [.0603-C-NOSILK]
R88  100k  R-US_0603-C-NOSILK  [.0603-C-NOSILK]
R89  100k  R-US_0603-C-NOSILK  [.0603-C-NOSILK]
R90  100k  R-US_0603-C-NOSILK  [.0603-C-NOSILK]
R91  100k  R-US_0603-C-NOSILK  [.0603-C-NOSILK]
R92  10m  R-US_1206-C  [1206-C]
R95  10  R-US_0603-C-NOSILK  [.0603-C-NOSILK]
R96  100  R-US_0603-C-NOSILK  [.0603-C-NOSILK]
R97  100k  R-US_0603-C-NOSILK  [.0603-C-NOSILK]
R101  10k  R-US_0603-C-NOSILK  [.0603-C-NOSILK]
R103  10k  R-US_0603-C-NOSILK  [.0603-C-NOSILK]
TP24  TEST-POINT-LARGE-SQUARE  [1X01]
TP49  TEST-POINT-LARGE-SQUARE  [1X01]
TP50  TEST-POINT-LARGE-SQUARE  [1X01]
TP51  TEST-POINT-LARGE-SQUARE  [1X01]
TP52  TEST-POINT-LARGE-SQUARE  [1X01]
TP53  TEST-POINT-LARGE-SQUARE  [1X01]
TP54  TEST-POINT-LARGE-SQUARE  [1X01]
TP55  TEST-POINT-LARGE-SQUARE  [1X01]
TP56  TEST-POINT-LARGE-SQUARE  [1X01]
TP58  TEST-POINT-LARGE-SQUARE  [1X01]
TP59  TEST-POINT-LARGE-SQUARE  [1X01]
TP61  TEST-POINT-LARGE-SQUARE  [1X01]
TP62  TEST-POINT-LARGE-SQUARE  [1X01]
TP63  TEST-POINT-LARGE-SQUARE  [1X01]
TP64  TEST-POINT-LARGE-SQUARE  [1X01]
TP65  TEST-POINT-LARGE-SQUARE  [1X01]
TP66  TEST-POINT-LARGE-SQUARE  [1X01]
TP67  TEST-POINT-LARGE-SQUARE  [1X01]
TP68  TEST-POINT-LARGE-SQUARE  [1X01]
TP69  TEST-POINT-LARGE-SQUARE  [1X01]
TP71  TEST-POINT-LARGE-SQUARE  [1X01]
U13  S-8209AAA-T8T1U  S-8209AXXT  [TSSOP8]
U14  S-8209AAA-T8T1U  S-8209AXXT  [TSSOP8]
U15  LTC4412  [SOT23-6]
U16  LTC4412  [SOT23-6]
U17  MAX17205G  [21-0137I_T1433-2]

### Nets
!CHARGE-PK2: Q37.4(G) R97.1 TP56.1 U14.7(CO)
!DISCHARGE-PK2: Q30.4(G) R56.1 TP55.1 U14.6(DO)
!SD [SHUTDOWN]: D7.C D8.C D13.C ; also sheet 1,5
AIN1-PK2: JP4.1 R103.1 U17.9(AIN1)
AIN2-PK2: JP3.1 R101.1 U17.10(AIN2)
ALERTA-PK2: TP71.1 U17.8(ALRT1) ; also sheet 3
CELL1-PK2: C31.2 C32.1 R96.2 TP69.1 U17.6(CELL2) U17.7(CELL1)
CHARGE-DISABLE-PK2: Q25.1(G) R77.2 ; also sheet 3
CHARGE-STAT-OC-PK2: TP68.1 U16.4(STAT) ; also sheet 3
CSP-PK2 [BATTERY]: B4.NEG-T(NEG) C26.2 C27.2 C32.2 Q24.2(S) Q25.2(S) Q26.2(S) Q27.2(S) R77.1 R80.1 R91.2 R92.1 TP65.1 U13.5(VSS) U17.2(CSP)
DCHG-STAT-OC-PK2: TP58.1 U15.4(STAT) ; also sheet 3
DISCHARGE-DISABLE-PK2: Q27.1(G) R80.2 ; also sheet 3
GND: C30.2 C33.2 C34.2 C35.2 C36.2 JP3.2 JP4.2 R92.2 TP66.1 U15.2(GND) U15.3(CTL) U16.2(GND) U16.3(CTL) U17.4(CSN) U17.EP(CSN) ; also sheet 1,2,3,5
I2C2_SCL: U17.11(SCL) ; also sheet 3
I2C2_SDA: U17.12(SDA) ; also sheet 3
INTERCELL-PK2 [BATTERY]: B3.NEG-T(NEG) C28.2 C29.2 Q35.5(D) Q35.6(D) Q35.7(D) Q35.8(D) Q35.PAD(D) R76.2 R79.1 R81.2 R90.2 R96.1 TP63.1 U14.5(VSS)
N$9 [BATTERY]: F4.1 Q37.5(D) Q37.6(D) Q37.7(D) Q37.8(D) Q37.PAD(D)
N$22: Q36.1(S) Q36.2(S) Q36.3(S) Q37.1(S) Q37.2(S) Q37.3(S) R97.2 TP67.1 U16.6(SENSE)
N$56: F2.1 Q30.1(S) Q30.2(S) Q30.3(S) R56.2
N$65: R83.1 U13.6(DO)
N$66: R82.1 U13.7(CO)
N$67: R83.2 TP54.1 U14.2(CTLD)
N$68: R82.2 TP53.1 U14.1(CTLC)
N$69: R75.2 TP49.1 U13.1(CTLC)
N$70: C28.1 R84.1 U14.3(VDD)
N$71: C26.1 R81.1 U13.3(VDD)
N$72: C29.1 U14.4(CDT)
N$73: C27.1 U13.4(CDT)
N$74: Q31.4(G) U15.5(GATE)
N$77: Q26.1(G) Q27.3(D) R79.2 TP52.1
N$78: R78.2 TP51.1 U13.2(CTLD)
N$79: Q26.3(D) R78.1
N$80: Q36.4(G) U16.5(GATE)
N$82 [BATTERY]: B3.POS-T(POS) Q32.2(S) Q34.1(S) Q34.2(S) Q34.3(S) R88.2 TP62.1
N$83: Q33.3(D) Q35.4(G) R91.1
N$84: D8.A Q33.1(G) R89.2
N$85 [BATTERY]: B4.POS-T(POS) Q33.2(S) Q35.1(S) Q35.2(S) Q35.3(S) R89.1 TP64.1
N$86: Q32.3(D) Q34.4(G) R90.1
N$87: D7.A Q32.1(G) R88.1
N$90: Q24.3(D) R75.1
N$91: D13.A Q24.1(G) Q25.3(D) R76.1 TP50.1
REG2-PK2: C36.1 U17.3(REG2)
REG3-PK2: C35.1 U17.1(REG3)
THRM-PK2: R101.2 R103.2 U17.14(THRM)
VBAT: C34.1 Q31.1(S) Q31.2(S) Q31.3(S) Q36.5(D) Q36.6(D) Q36.7(D) Q36.8(D) Q36.PAD(D) TP59.1 U15.6(SENSE) U16.1(VIN) ; also sheet 1,5
VBATT-F-PK2 [BATTERY]: C30.1 Q30.5(D) Q30.6(D) Q30.7(D) Q30.8(D) Q30.PAD(D) Q31.5(D) Q31.6(D) Q31.7(D) Q31.8(D) Q31.PAD(D) TP24.1 U15.1(VIN)
VBATT-PK2 [BATTERY]: F2.2 F4.2 Q34.5(D) Q34.6(D) Q34.7(D) Q34.8(D) Q34.PAD(D) R84.2 R95.2 TP61.1
VBATT-PL2: C31.1 C33.1 R95.1 U17.5(VBATT)
Unconnected: U13.8(CB) U14.8(CB) U17.13(CELLX)

### Notes on the sheet
- DISCHARGE SWITCH | CHARGE SWITCH
- (Current flows when Vbat > Vbus) | (Current flows when Vbat < Vbus)
- DISCHARGE ONLY IF:
  1) Vcell > Voverdisch
  2) DISCHARGE_DISABLE is not asserted.
- CHARGE ONLY IF:
  1) Vcell < Vovercharge
  2) CHARGE_DISABLE is not asserted.
- PTC-5A | PTC-2A
- Fuel Gauge + Cell Balancing
- S-8209A has a Vov = 4.100V (release = 4.000V)
  and a Vuv = 2.500V (release = 2.700V)
- 100 ms of delay
- CTLC/D
  has 
  internal
  pullups
  to VDD
- 100 ms delay on 
  all transitions
- Note: the S8209 has capability for cell balancing that we are not utilizing 
  in favor of the MAX17205 cell balancing
- Battery Pack 
  w/shutdown
- B1 | B2
- If !SD is asserted, disable charging as possible. This is a bit strange
  because the Ablic ICs should be powered off; however, if there's
  an external supply that powers up the Ablics, disable charging.
- NTC Thermistors
- 2x Honeywell 197-103LAG-A01
- Kelvin
  Connection
- 1206
- Discharge is enabled by default but will be turned off
  if DISCHARGE-DISABLE is asserted or if Vcell < Voverdischarge
- Charge (slow) is enabled by default but can be turned off
  if CHARGE-DISABLE is asserted or if Vcell > Vovercharge
- OreSat battery Card - Battery Pack 2
- Referenced to B2- (top of shunt), not system 
  GND which is bottom of shunt.
- 1.0
- ALL CAPS ARE 0603, 10%,  X5R, WV >= 16 V UNLESS OTHERWISE NOTED
  ALL RESISTORS ARE 0603 1% UNLESS OTHERWISE NOTED

## Sheet 5 of 5: Battery Pack 1 (BOTTOM)
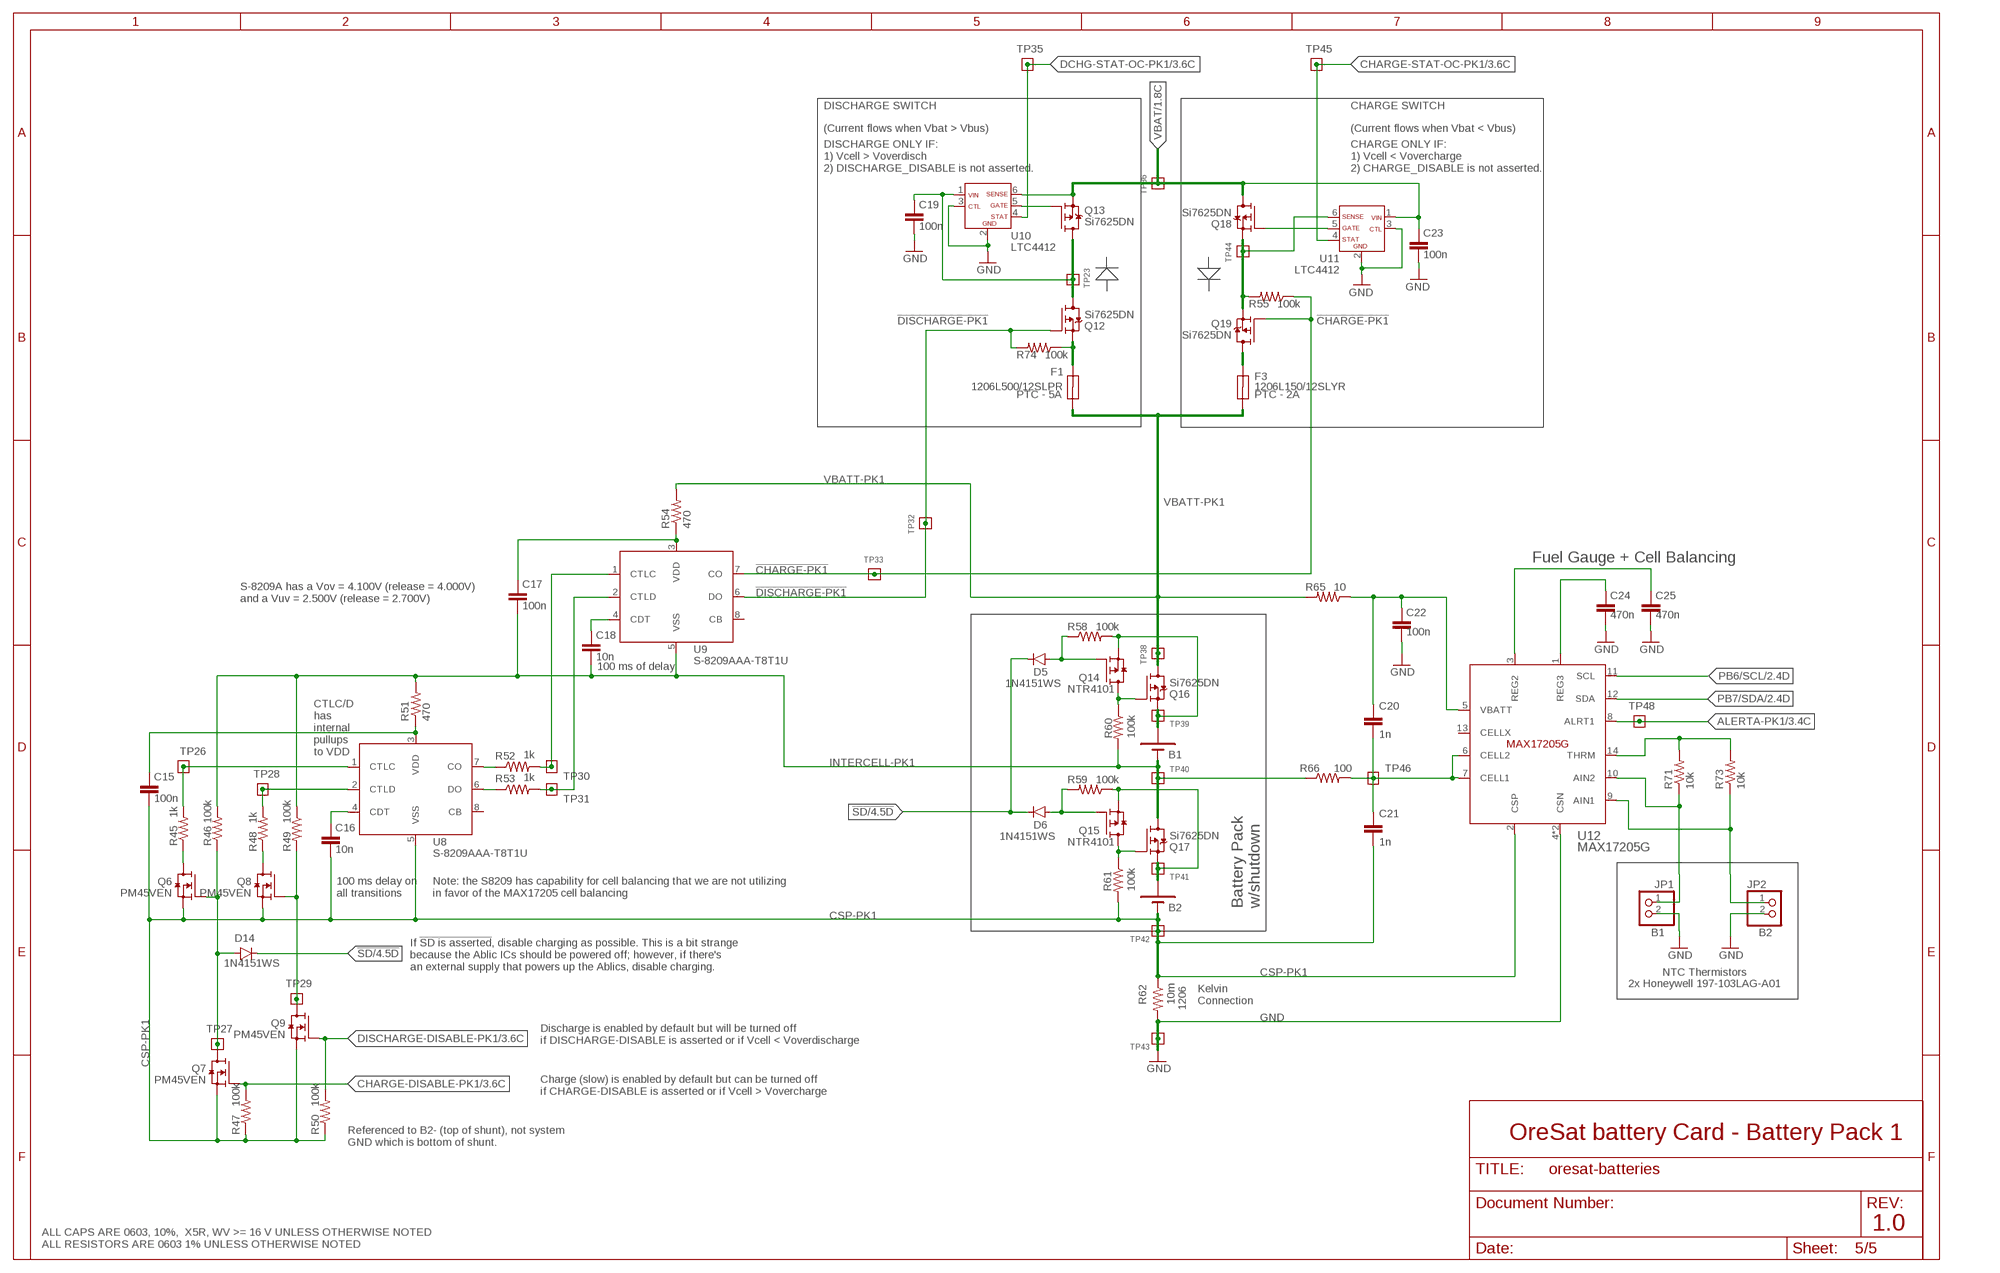
[diagram p4: schematic, sheet 5]

### Parts
B1  B-18650-LI-BATTERY  [18650]
B2  B-18650-LI-BATTERY  [18650]
C15  100n  C-EU0603-C-NOSILK  [.0603-C-NOSILK]
C16  10n  C-EU0603-C-NOSILK  [.0603-C-NOSILK]
C17  100n  C-EU0603-C-NOSILK  [.0603-C-NOSILK]
C18  10n  C-EU0603-C-NOSILK  [.0603-C-NOSILK]
C19  100n  C-EU0603-C-NOSILK  [.0603-C-NOSILK]
C20  1n  C-EU0603-C-NOSILK  [.0603-C-NOSILK]
C21  1n  C-EU0603-C-NOSILK  [.0603-C-NOSILK]
C22  100n  C-EU0603-C-NOSILK  [.0603-C-NOSILK]
C23  100n  C-EU0603-C-NOSILK  [.0603-C-NOSILK]
C24  470n  C-EU0603-C-NOSILK  [.0603-C-NOSILK]
C25  470n  C-EU0603-C-NOSILK  [.0603-C-NOSILK]
D5  1N4151WS  DIODE-SOD323-R  [SOD323-R]
D6  1N4151WS  DIODE-SOD323-R  [SOD323-R]
D14  1N4151WS  DIODE-SOD323-R  [SOD323-R]
F1  1206L500/12SLPR  GENERIC-FUSE-1206  [1206-C]
F3  1206L150/12SLYR  GENERIC-FUSE-1206  [1206-C]
JP1  PINHD-1X2  [1X02]
JP2  PINHD-1X2  [1X02]
Q6  PM45VEN  N-MOSFET-SOT-23-3  [SOT23-3]
Q7  PM45VEN  N-MOSFET-SOT-23-3  [SOT23-3]
Q8  PM45VEN  N-MOSFET-SOT-23-3  [SOT23-3]
Q9  PM45VEN  N-MOSFET-SOT-23-3  [SOT23-3]
Q12  Si7625DN  Q-VISHAY-MOSFET-PCH-POWERPAK-1212-8  [POWERPAK-1212-8]
Q13  Si7625DN  Q-VISHAY-MOSFET-PCH-POWERPAK-1212-8  [POWERPAK-1212-8]
Q14  NTR4101  P-MOSFET-SOT23-3  [SOT23-3]
Q15  NTR4101  P-MOSFET-SOT23-3  [SOT23-3]
Q16  Si7625DN  Q-VISHAY-MOSFET-PCH-POWERPAK-1212-8  [POWERPAK-1212-8]
Q17  Si7625DN  Q-VISHAY-MOSFET-PCH-POWERPAK-1212-8  [POWERPAK-1212-8]
Q18  Si7625DN  Q-VISHAY-MOSFET-PCH-POWERPAK-1212-8  [POWERPAK-1212-8]
Q19  Si7625DN  Q-VISHAY-MOSFET-PCH-POWERPAK-1212-8  [POWERPAK-1212-8]
R45  1k  R-US_0603-C-NOSILK  [.0603-C-NOSILK]
R46  100k  R-US_0603-C-NOSILK  [.0603-C-NOSILK]
R47  100k  R-US_0603-C-NOSILK  [.0603-C-NOSILK]
R48  1k  R-US_0603-C-NOSILK  [.0603-C-NOSILK]
R49  100k  R-US_0603-C-NOSILK  [.0603-C-NOSILK]
R50  100k  R-US_0603-C-NOSILK  [.0603-C-NOSILK]
R51  470  R-US_0603-C-NOSILK  [.0603-C-NOSILK]
R52  1k  R-US_0603-C-NOSILK  [.0603-C-NOSILK]
R53  1k  R-US_0603-C-NOSILK  [.0603-C-NOSILK]
R54  470  R-US_0603-C-NOSILK  [.0603-C-NOSILK]
R55  100k  R-US_0603-C-NOSILK  [.0603-C-NOSILK]
R58  100k  R-US_0603-C-NOSILK  [.0603-C-NOSILK]
R59  100k  R-US_0603-C-NOSILK  [.0603-C-NOSILK]
R60  100k  R-US_0603-C-NOSILK  [.0603-C-NOSILK]
R61  100k  R-US_0603-C-NOSILK  [.0603-C-NOSILK]
R62  10m  R-US_1206-C  [1206-C]
R65  10  R-US_0603-C-NOSILK  [.0603-C-NOSILK]
R66  100  R-US_0603-C-NOSILK  [.0603-C-NOSILK]
R71  10k  R-US_0603-C-NOSILK  [.0603-C-NOSILK]
R73  10k  R-US_0603-C-NOSILK  [.0603-C-NOSILK]
R74  100k  R-US_0603-C-NOSILK  [.0603-C-NOSILK]
TP23  TEST-POINT-LARGE-SQUARE  [1X01]
TP26  TEST-POINT-LARGE-SQUARE  [1X01]
TP27  TEST-POINT-LARGE-SQUARE  [1X01]
TP28  TEST-POINT-LARGE-SQUARE  [1X01]
TP29  TEST-POINT-LARGE-SQUARE  [1X01]
TP30  TEST-POINT-LARGE-SQUARE  [1X01]
TP31  TEST-POINT-LARGE-SQUARE  [1X01]
TP32  TEST-POINT-LARGE-SQUARE  [1X01]
TP33  TEST-POINT-LARGE-SQUARE  [1X01]
TP35  TEST-POINT-LARGE-SQUARE  [1X01]
TP36  TEST-POINT-LARGE-SQUARE  [1X01]
TP38  TEST-POINT-LARGE-SQUARE  [1X01]
TP39  TEST-POINT-LARGE-SQUARE  [1X01]
TP40  TEST-POINT-LARGE-SQUARE  [1X01]
TP41  TEST-POINT-LARGE-SQUARE  [1X01]
TP42  TEST-POINT-LARGE-SQUARE  [1X01]
TP43  TEST-POINT-LARGE-SQUARE  [1X01]
TP44  TEST-POINT-LARGE-SQUARE  [1X01]
TP45  TEST-POINT-LARGE-SQUARE  [1X01]
TP46  TEST-POINT-LARGE-SQUARE  [1X01]
TP48  TEST-POINT-LARGE-SQUARE  [1X01]
U8  S-8209AAA-T8T1U  S-8209AXXT  [TSSOP8]
U9  S-8209AAA-T8T1U  S-8209AXXT  [TSSOP8]
U10  LTC4412  [SOT23-6]
U11  LTC4412  [SOT23-6]
U12  MAX17205G  [21-0137I_T1433-2]

### Nets
!CHARGE-PK1: Q19.4(G) R55.1 TP33.1 U9.7(CO)
!DISCHARGE-PK1: Q12.4(G) R74.2 TP32.1 U9.6(DO)
!SD [SHUTDOWN]: D5.C D6.C D14.C ; also sheet 1,4
AIN1-PK1: JP2.1 R73.1 U12.9(AIN1)
AIN2-PK1: JP1.1 R71.1 U12.10(AIN2)
ALERTA-PK1: TP48.1 U12.8(ALRT1) ; also sheet 3
CELL1-PK1: C20.2 C21.1 R66.2 TP46.1 U12.6(CELL2) U12.7(CELL1)
CHARGE-DISABLE-PK1: Q7.1(G) R47.2 ; also sheet 3
CHARGE-STAT-OC-PK1: TP45.1 U11.4(STAT) ; also sheet 3
CSP-PK1 [BATTERY]: B2.NEG-T(NEG) C15.2 C16.2 C21.2 Q6.2(S) Q7.2(S) Q8.2(S) Q9.2(S) R47.1 R50.1 R61.2 R62.1 TP42.1 U8.5(VSS) U12.2(CSP)
DCHG-STAT-OC-PK1: TP35.1 U10.4(STAT) ; also sheet 3
DISCHARGE-DISABLE-PK1: Q9.1(G) R50.2 ; also sheet 3
GND: C19.2 C22.2 C23.2 C24.2 C25.2 JP1.2 JP2.2 R62.2 TP43.1 U10.2(GND) U10.3(CTL) U11.2(GND) U11.3(CTL) U12.4(CSN) U12.EP(CSN) ; also sheet 1,2,3,4
INTERCELL-PK1 [BATTERY]: B1.NEG-T(NEG) C17.2 C18.2 Q17.5(D) Q17.6(D) Q17.7(D) Q17.8(D) Q17.PAD(D) R46.2 R49.1 R51.2 R60.2 R66.1 TP40.1 U9.5(VSS)
N$2: R53.2 TP31.1 U9.2(CTLD)
N$3: R53.1 U8.6(DO)
N$4: R52.2 TP30.1 U9.1(CTLC)
N$5: Q8.3(D) R48.1
N$6: R52.1 U8.7(CO)
N$7: C16.1 U8.4(CDT)
N$8: Q13.4(G) U10.5(GATE)
N$10: Q6.3(D) R45.1
N$11: Q8.1(G) Q9.3(D) R49.2 TP29.1
N$12: C18.1 U9.4(CDT)
N$14: R45.2 TP26.1 U8.1(CTLC)
N$15: Q14.3(D) Q16.4(G) R60.1
N$16: C17.1 R54.1 U9.3(VDD)
N$17: C15.1 R51.1 U8.3(VDD)
N$37: R48.2 TP28.1 U8.2(CTLD)
N$40: D6.A Q15.1(G) R59.2
N$42 [BATTERY]: B1.POS-T(POS) Q14.2(S) Q16.1(S) Q16.2(S) Q16.3(S) R58.2 TP39.1
N$43: Q18.4(G) U11.5(GATE)
N$46: Q15.3(D) Q17.4(G) R61.1
N$48 [BATTERY]: F3.1 Q19.5(D) Q19.6(D) Q19.7(D) Q19.8(D) Q19.PAD(D)
N$50: D5.A Q14.1(G) R58.1
N$51: D14.A Q6.1(G) Q7.3(D) R46.1 TP27.1
N$53 [BATTERY]: B2.POS-T(POS) Q15.2(S) Q17.1(S) Q17.2(S) Q17.3(S) R59.1 TP41.1
N$100 [BATTERY]: F1.1 Q12.1(S) Q12.2(S) Q12.3(S) R74.1
N$109 [BATTERY]: Q18.1(S) Q18.2(S) Q18.3(S) Q19.1(S) Q19.2(S) Q19.3(S) R55.2 TP44.1 U11.6(SENSE)
PB6/SCL: U12.11(SCL) ; also sheet 2,3
PB7/SDA: U12.12(SDA) ; also sheet 2,3
REG2-PK1: C25.1 U12.3(REG2)
REG3-PK1: C24.1 U12.1(REG3)
THRM-PK1: R71.2 R73.2 U12.14(THRM)
VBAT: C23.1 Q13.1(S) Q13.2(S) Q13.3(S) Q18.5(D) Q18.6(D) Q18.7(D) Q18.8(D) Q18.PAD(D) TP36.1 U10.6(SENSE) U11.1(VIN) ; also sheet 1,4
VBATT-F-PK1 [BATTERY]: C19.1 Q12.5(D) Q12.6(D) Q12.7(D) Q12.8(D) Q12.PAD(D) Q13.5(D) Q13.6(D) Q13.7(D) Q13.8(D) Q13.PAD(D) TP23.1 U10.1(VIN)
VBATT-PK1 [BATTERY]: F1.2 F3.2 Q16.5(D) Q16.6(D) Q16.7(D) Q16.8(D) Q16.PAD(D) R54.2 R65.2 TP38.1
VBATT-PL1: C20.1 C22.1 R65.1 U12.5(VBATT)
Unconnected: U8.8(CB) U9.8(CB) U12.13(CELLX)

### Notes on the sheet
- DISCHARGE SWITCH | CHARGE SWITCH
- (Current flows when Vbat > Vbus) | (Current flows when Vbat < Vbus)
- DISCHARGE ONLY IF:
  1) Vcell > Voverdisch
  2) DISCHARGE_DISABLE is not asserted.
- CHARGE ONLY IF:
  1) Vcell < Vovercharge
  2) CHARGE_DISABLE is not asserted.
- PTC - 5A | PTC - 2A
- Fuel Gauge + Cell Balancing
- S-8209A has a Vov = 4.100V (release = 4.000V)
  and a Vuv = 2.500V (release = 2.700V)
- 100 ms of delay
- CTLC/D
  has 
  internal
  pullups
  to VDD
- 100 ms delay on 
  all transitions
- Note: the S8209 has capability for cell balancing that we are not utilizing 
  in favor of the MAX17205 cell balancing
- Battery Pack 
  w/shutdown
- B1 | B2
- If !SD is asserted, disable charging as possible. This is a bit strange
  because the Ablic ICs should be powered off; however, if there's
  an external supply that powers up the Ablics, disable charging.
- NTC Thermistors
- 2x Honeywell 197-103LAG-A01
- Kelvin
  Connection
- 1206
- Discharge is enabled by default but will be turned off
  if DISCHARGE-DISABLE is asserted or if Vcell < Voverdischarge
- Charge (slow) is enabled by default but can be turned off
  if CHARGE-DISABLE is asserted or if Vcell > Vovercharge
- OreSat battery Card - Battery Pack 1
- Referenced to B2- (top of shunt), not system 
  GND which is bottom of shunt.
- 1.0
- ALL CAPS ARE 0603, 10%,  X5R, WV >= 16 V UNLESS OTHERWISE NOTED
  ALL RESISTORS ARE 0603 1% UNLESS OTHERWISE NOTED

## Library data of the parts
B1-B4 = B-18650-Li-battery:B-18650-LI-BATTERY; DIS: Tenergy; DPN: MH48285; MFR: Tenergy; MPN: MH48285
C1 C2 C4 = oresat-rcl:C-EU: CAPACITOR, European symbol; DIS: Digi-Key; DPN: 1276-6524-1-ND; MFR: Samsung; MPN: CL10B105MO8NNWC
C3 C9 = oresat-rcl:C-EU: CAPACITOR, European symbol; DIS: Digi-Key; DPN: 399-1099-1-ND; MFR: Samsung; MPN: CL05B104KO5NNNC
C5 C10 C11 = oresat-rcl:C-EU: CAPACITOR, European symbol; DIS: Digi-Key; DPN: 1276-2893-1-ND; MFR: Samsung; MPN: CL21A106KOFNNNE
C6 = oresat-rcl:C-EU: CAPACITOR, European symbol; DIS: Digi-Key; DPN: 311-1446-1-ND; MFR: Yageo; MPN: CC0603KRX7R7BB105
C7 = oresat-rcl:C-EU: CAPACITOR, European symbol
C8 = oresat-rcl:C-EU: CAPACITOR, European symbol; DIS: Digi-Key; DPN: 490-10511-1-ND; MFR: Murata; MPN: GRM21BR61A226ME51L
C15 C17 C19 C22 C23 C26 C28 C30 C33 C34 = oresat-rcl:C-EU: CAPACITOR, European symbol; DIS: Digi-Key; DPN: 399-1099-1-ND; MFR: Kemet; MPN: C0603C104M4RACTU
C16 C18 = oresat-rcl:C-EU: CAPACITOR, European symbol; DIS: Digi-Key; DPN: 399-7842-1-ND; MFR: Kemet; MPN: C0603C103M5RACTU
C20 C21 C31 C32 = oresat-rcl:C-EU: CAPACITOR, European symbol; DIS: Digi-Key; DPN: 311-1080-1-ND; MFR: Yageo; MPN: CC0603KRX7R9BB102
C24 C25 C35 C36 = oresat-rcl:C-EU: CAPACITOR, European symbol; DIS: Digi-Key; DPN: 399-7934-1-ND; MFR: Kemet; MPN: C0603C474K4PACTU
C27 C29 = oresat-rcl:C-EU: CAPACITOR, European symbol; DPN: 399-7842-1-ND; MFR: Kemet; MPN: C0603C103M5RACTU
C44 C45 C48-C50 = oresat-rcl:C-EU: CAPACITOR, European symbol; DIS: Digi-Key; DPN: 399-1099-1-ND; MFR: Samsung; MPN: C0603C104M4RACTU
C46 C47 = oresat-rcl:C-EU: CAPACITOR, European symbol; DIS: Digi-Key; DPN: 311-1424-1-ND; MFR: Yageo; MPN: CC0603JRNPO9BN200
D1 = SparkFun-LED:LED-GREEN: Green SMD LED Used in manufacturing of various products at SparkFun Packages: 0603 - SMD 0603 package [Product Link] <http://www.futureelectronics.com/en/technologies/semiconductors/optoelectronics/leds/Pages/9894312-LTST-C190GKT.aspx?CrossPart=HSMG-C190&IM=0> LilyPad 1206 - SMD1206 LilyPad package [Product Link] <http://www.futureelectronics.com/en/Technologies/Product.aspx?ProductID=IN150NGHARVATEKCORPORATION2049943&IM=0> 1206 - SMD1206 package [Product Link] <http://www.futureelectronics.com/en/technologies/semiconductors/optoelectronics/leds/Pages/8315665-LTST-C150KGKT.aspx?IM=0> 1206 Bottom Mount -SMD 1206 Bottom Mount [Product Link] <http://www.digikey.com/product-detail/en/lite-on-inc/LTST-C230KGKT/160-1456-1-ND/386854> SparkFun Products: Pro Mini 328 -5V <https://www.sparkfun.com/products/821> RedBoard <https://www.sparkfun.com/products/12757> MP3 Trigger <https://www.sparkfun.com/products/13720> Makey Makey <https://www.sparkfun.com/products/11076>; DIS: Digi-Key; DPN: 1830-1064-1-ND; MFR: Inolux; MPN: IN-S63AT5A
D2 D3 = SparkFun-LED:LED-GREEN: Green SMD LED Used in manufacturing of various products at SparkFun Packages: 0603 - SMD 0603 package [Product Link] <http://www.futureelectronics.com/en/technologies/semiconductors/optoelectronics/leds/Pages/9894312-LTST-C190GKT.aspx?CrossPart=HSMG-C190&IM=0> LilyPad 1206 - SMD1206 LilyPad package [Product Link] <http://www.futureelectronics.com/en/Technologies/Product.aspx?ProductID=IN150NGHARVATEKCORPORATION2049943&IM=0> 1206 - SMD1206 package [Product Link] <http://www.futureelectronics.com/en/technologies/semiconductors/optoelectronics/leds/Pages/8315665-LTST-C150KGKT.aspx?IM=0> 1206 Bottom Mount -SMD 1206 Bottom Mount [Product Link] <http://www.digikey.com/product-detail/en/lite-on-inc/LTST-C230KGKT/160-1456-1-ND/386854> SparkFun Products: Pro Mini 328 -5V <https://www.sparkfun.com/products/821> RedBoard <https://www.sparkfun.com/products/12757> MP3 Trigger <https://www.sparkfun.com/products/13720> Makey Makey <https://www.sparkfun.com/products/11076>; DIS: Digi-Key; DPN: 511-1584-1-ND; MFR: Rohm; MPN: SML-E12M8WT86
D4-D9 D11-D14 = D-Generic-silicon-SOD-323:DIODE-: DIODE; DIS: Digi-Key; DPN: 112-1N4151WS-E3-08CT-ND; MFR: Vishay; MPN: 1N4151WS-E3-08
D10 = SparkFun-LED:LED-GREEN: Green SMD LED Used in manufacturing of various products at SparkFun Packages: 0603 - SMD 0603 package [Product Link] <http://www.futureelectronics.com/en/technologies/semiconductors/optoelectronics/leds/Pages/9894312-LTST-C190GKT.aspx?CrossPart=HSMG-C190&IM=0> LilyPad 1206 - SMD1206 LilyPad package [Product Link] <http://www.futureelectronics.com/en/Technologies/Product.aspx?ProductID=IN150NGHARVATEKCORPORATION2049943&IM=0> 1206 - SMD1206 package [Product Link] <http://www.futureelectronics.com/en/technologies/semiconductors/optoelectronics/leds/Pages/8315665-LTST-C150KGKT.aspx?IM=0> 1206 Bottom Mount -SMD 1206 Bottom Mount [Product Link] <http://www.digikey.com/product-detail/en/lite-on-inc/LTST-C230KGKT/160-1456-1-ND/386854> SparkFun Products: Pro Mini 328 -5V <https://www.sparkfun.com/products/821> RedBoard <https://www.sparkfun.com/products/12757> MP3 Trigger <https://www.sparkfun.com/products/13720> Makey Makey <https://www.sparkfun.com/products/11076>; DIS: Digi-Key; DPN: 1830-1064-1-ND; MFR: Inolux; MPN: IN-S63AT5A; VALUE: GREEN
F1-F4 = F-Generic-Fuse-1206:GENERIC-FUSE-1206: Generic Fuse in 1206 package; DIS: Digi-Key; DPN: F9966CT-ND; MFR: LittleFuse; MPN: NANOSMD350LR-C-2
FIDUCIAL1-FIDUCIAL3 = dock_v2:FIDUCIAL: Fiducials for optical coordinate reference
J1 = J-Samtec-TFM-120-X1-XXX-D-RA:J-SAMTEC-TFM-120-X1-XXX-D-RA; MFR: Samtec; MPN: TFM-120-01-L-D-RA
J2 = J-Samtec-FTS-102-01-1.27mm-th:SAMTEC-FTS-102-01-X-S
J4 = oresat-debug-connector:ORESAT-DEBUG-CONNECTOR; DIS: Digi-Key; DPN: A100287CT-ND; MFR: TE; MPN: 2-1734592-0
JP1-JP4 = pinhead:PINHD-1X2: PIN HEADER
JP14-JP17 = pinhead:PINHD-1X1: PIN HEADER
L1 = L-ECS-MPI4040:L-ECS-MPI4040; DIS: Digi-Key; DPN: XC2337CT-ND; MFR: ECS; MPN: ECS-MPI4040R4-6R8-R
Q1 = Q-MOSFET-PCH-dual-SOT23-6:MOSFET-PCH-SOT23-6: Dual P channel MOSFETs in an SOT23-6; DIS: Digi-Key; DPN: GRM21BR61A226ME51L; MFR: Diodes Inc; MPN: DMP2240UDM
Q2 Q5-Q9 Q24-Q27 Q44 = Q-MOSFET-NCH-SOT23-3:N-MOSFET-SOT-23-3: Generic N-Channel MOSFET in an SOT23-3 package. Be sure to check that the pin out is correct for your particular MOSFET! Compatible with Nexperia PMV45EN, ON Semi BSS138, and ST 2N7000.; DIS: Digi-Key; DPN: 1727-2307-1-ND; MFR: Nexperia; MPN: PMV45EN2R
Q3 Q4 = Q-MOSFET-PCH-SOT23-6:MOSFET-PCH-SOT23-6: P channel MOSFET in an SOT23-6; DIS: Digi-Key; DPN: DMP3050LVT-7DICT-ND; MFR: Diodes Inc; MPN: DMP3050LVT-7
Q12 Q13 Q16-Q19 Q30 Q31 Q34-Q37 = Q-VIshay-MOSFET-PCH-PowerPak121-8:Q-VISHAY-MOSFET-PCH-POWERPAK-1212-8; DIS: Digi-Key; DPN: SI7625DN-T1-GE3CT-ND; MFR: Vishay; MPN: SI7625DN-T1-GE3
Q14 Q15 Q32 Q33 = Q-MOSFET-PCH-SOT23-3:P-MOSFET-SOT23-3: Generic P channel MOSFET in an SOT23-3 package. BE SURE TO CHECK YOUR PINOUTS!! Compatible with the ON Semi NTR4101, Nexperia BSS84, Vishay BS250.; DIS: Digi-Key; DPN: NTR4101PT1GOSCT-ND; MFR: ON Semi; MPN: NTR4101PT1G
Q20 Q21 Q38 Q39 = Q-MOSFET-NCH-SOT23-3:N-MOSFET-SOT-23-3: Generic N-Channel MOSFET in an SOT23-3 package. Be sure to check that the pin out is correct for your particular MOSFET! Compatible with Nexperia PMV45EN, ON Semi BSS138, and ST 2N7000.
Q42 Q43 = Q-MOSFET-PCH-dual-SOT23-6:MOSFET-PCH-SOT23-6: Dual P channel MOSFETs in an SOT23-6
R1 R65 R95 = oresat-rcl:R-US_: RESISTOR, American symbol; DIS: Digi-Key; DPN: 311-10.0HRCT-ND; MFR: Yageo; MPN: RC0603FR-0710RL
R2-R5 R8-R17 R57 R67 = oresat-rcl:R-US_: RESISTOR, American symbol; DIS: Digi-Key; DPN: 311-665KHRCT-ND; MFR: Yageo; MPN: RC0603FR-07665KL
R6 R7 R66 R96 = oresat-rcl:R-US_: RESISTOR, American symbol; DIS: Digi-Key; DPN: 311-100HRCT-ND; MFR: Yageo; MPN: RC0603FR-07100RL
R18 R24 R25 R28 R31 R32 R37 R38 R40-R44 R47 R50 R73 R77 R80 R103 R105 R106 R110 R112 = oresat-rcl:R-US_: RESISTOR, American symbol; DIS: Digi-Key; DPN: 311-10.0KHRCT-ND; MFR: Yageo; MPN: RC0603FR-0710KL
R19 R20 = oresat-rcl:R-US_: RESISTOR, American symbol; DIS: Digi-Key; DPN: A129718CT-ND; MFR: TE; MPN: CRGCQ0603F330K
R21 R22 R46 R49 R58-R61 R76 R79 R88-R91 = oresat-rcl:R-US_: RESISTOR, American symbol; DIS: Digi-Key; DPN: 311-1.00MHRCT-ND; MFR: Yageo; MPN: RC0603FR-071ML
R23 R36 R39 R111 = oresat-rcl:R-US_: RESISTOR, American symbol; DIS: Digi-Key; DPN: A129693CT-ND; MFR: TE; MPN: CRGCQ0603F2K7
R26 R27 R29 R35 = oresat-rcl:R-US_: RESISTOR, American symbol; DIS: Digi-Key; DPN: 1276-4275-1-ND; MFR: Samsung; MPN: RC1005F6653CS
R30 = oresat-rcl:R-US_: RESISTOR, American symbol; DIS: Digi-Key; DPN: CSR1206FTR100CT-ND; MFR: Stackpole; MPN: CSR1206FTR100
R33 = oresat-rcl:R-US_: RESISTOR, American symbol; DIS: Digi-Key; DPN: 311-0.0GRCT-ND; MFR: Yageo; MPN: RC0603JR-070RL
R34 = oresat-rcl:R-US_: RESISTOR, American symbol; DIS: Digi-Key; DPN: RR08P20.0KDCT-ND; MFR: Samsung; MPN: RR0816P-203-D
R45 R48 R52 R53 = oresat-rcl:R-US_: RESISTOR, American symbol; DIS: Yageo; DPN: RC0603JR-071KL; MPN: 311-1.0KGRCT-ND
R51 R54 R81 R84 = oresat-rcl:R-US_: RESISTOR, American symbol; DIS: Digi-Key; DPN: 311-470GRCT-ND; MFR: Yageo; MPN: RC0603JR-07470RL
R55 R74 = oresat-rcl:R-US_: RESISTOR, American symbol; DIS: Digi-Key; DPN: RR08P100KDCT-ND; MFR: Susumu; MPN: RR0816P-104-D
R56 R97 = oresat-rcl:R-US_: RESISTOR, American symbol; DIS: Digi-Key; DPN: RR08P100KDCT-ND; MFR: Yageo; MPN: RR0816P-104-D
R62 R92 = oresat-rcl:R-US_: RESISTOR, American symbol; DIS: Digi-Key; DPN: 696-1374-1-ND; MFR: Riedon; MPN: CSR1206-0R01F1
R63 R64 R68 R72 R113 R114 = oresat-rcl:R-US_: RESISTOR, American symbol; DIS: Digi-Key; DPN: RR08P4.7KDCT-ND; MFR: TE Connectivity; MPN: RR0816P-472-D
R71 R101 = oresat-rcl:R-US_: RESISTOR, American symbol; DIS: Digi-Key; DISTRIBUTOR: Digi-key; DPN: 311-10.0KHRCT-ND; MFR: Yageo; MPN: RC0603FR-0710KL
R75 R78 R82 R83 = oresat-rcl:R-US_: RESISTOR, American symbol; DIS: Digi-Key; DPN: 311-1.0KGRCT-ND; MFR: Yageo; MPN: RC0603JR-071KL
SW1-SW4 = SW-Omron-D2F-L3-D-switch:OMRON-D2F-L3-D
TP1-TP33 TP35 TP36 TP38-TP46 TP48-TP59 TP61-TP69 TP71 TP78-TP83 = oresat-misc:TEST-POINT-LARGE-SQUARE
U1 = U-Maxim-MAX7310-I2C-GPIO-expander:MAX7310; DIS: Digi-Key; DPN: MAX7310ATE+-ND; MFR: Maxim; MPN: MAX7310ATE
U2 = U-Microchip-MIC842-Comparator:MIC842L; DIS: Digi-Key; DPN: 576-2927-1-ND; MFR: Microchip; MPN: MIC842LYC5-TR
U3 = U-Microchip-MIC842-Comparator:MIC842L
U4 = U-Maxim-MAX4211-power-monitor:MAX4211; DIS: Digi-Key; DPN: MAX4211FETE+-ND; MFR: Maxim; MPN: MAX4211FETE
U5 = U-TI-TPS6211x-SPS-buck:TPS6211X: TPS6211x 17-V, 1.5-A, Synchronous Step-Down Converter; DIS: Digi-Key; DPN: 296-37681-2-ND; MFR: Texas Instruments; MPN: TPS62111RSA
U6 = U-TI-TS5A21366-2xSPST-analog-switch:TS5A21366DCUR; COPYRIGHT: Copyright (C) 2021 Ultra Librarian. All rights reserved.; DIGI-KEY_PART_NUMBER_1: 296-24304-1-ND; DIGI-KEY_PART_NUMBER_2: 296-24304-2-ND; DIGI-KEY_PART_NUMBER_3: 296-24304-6-ND; DIGI-KEY_PART_NUMBER_4: 2156-TS5A21366DCUR-ND; MANUFACTURER_PART_NUMBER: TS5A21366DCUR; MFR_NAME: Texas Instruments; REFDES: RefDes; TYPE: TYPE
U8 U9 U13 U14 = U-ABLIC-s8209A-BattProtection:S-8209AXX; MFR: Ablic; MPN: S-8209AAA-T8T1U
U10 U11 U15 U16 = U-LT-LTC4412-ideal-diode:LTC4412; DIS: Digi-Key; DPN: LTC4412ES6#TRPBFCT-ND; MFR: Analog Devices; MPN: LTC4412ES6#TRPBF
U12 = U-Maxim-MAX17205-Fuel_Gauge:MAX17205G; DIS: Distributor; DPN: MAX17205G+TCT-ND; MFR: Maxim; MPN: MAX17205G+T
U17 = U-Maxim-MAX17205-Fuel_Gauge:MAX17205G; DIS: Digi-Key; DPN: MAX17205G+TCT-ND; MFR: Maxim; MPN: MAX17205G+T
U20 = TCAN330:TCAN330; DIS: Digi-Key; DPN: 296-44211-1-ND; MFR: Texas Instruments; MPN: TCAN330GDCNT
U21 = U-ST-STM32F091C-uC:STM32F091C; DIS: Digi-Key; DPN: 497-17364-ND; MFR: STMicroelectronics; MPN: STM32F091CBT6
U$1 = oresat-flight-marker:FLIGHMARKER
X3 = low-gain-radio:CRYSTAL-WITH-GND; DIS: Digi-Key; DPN: XC2181CT-ND; MFR: ECS Inc.; MPN: ECS-160-10-36Q-ES-TR

## Net classes
1 SHUTDOWN: clearance 0.2 mm
2 BATTERY: clearance 0.2 mm